# Altium project US_EPS_HW.PrjPcb (part 1 of 2)
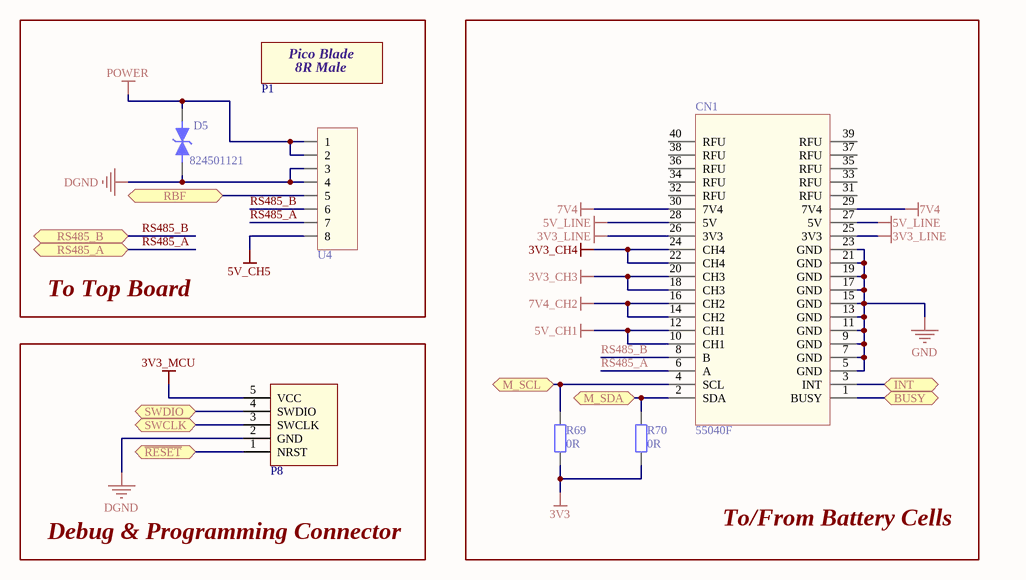
[diagram p0: US_EPS_BIC.SchDoc]
hwver: v0.2
9 sheets, 370 parts. Net scope: hierarchical (ports join the sheet entries above them; power ports are global).
Board file: US_EPS_GHW.PcbDoc
Sheets:
  US_EPS_BIC.SchDoc
  US_EPS_BR.SchDoc
  US_EPS_GHW.SchDoc
  US_EPS_HW.SchDoc
  US_EPS_LM.SchDoc
  US_EPS_MCU.SchDoc
  US_EPS_RBF.SchDoc
  US_EPS_RS485.SchDoc
  US_EPS_SP.SchDoc

## Sheet US_EPS_BIC.SchDoc
size A4

### Parts
CN1  55040F  [HEADER_40PIN_12MM2]
D5  824501121  [DIOM4227X25N]
P1  PicoBlade_8R_MALE  (value not drawn)  (mechanical)
P8  SWD  [SWD_CON_VAR1]  (value not drawn)  (no BOM)
R69  0R  [R0603_IPC_MD]  (no BOM)
R70  0R  [R0603_IPC_MD]  (no BOM)
U4  PicoBlade_8R  [PB_53398-0871_RIGHT]  (value not drawn)

### Blocks framed on the sheet
To Top Board: D5 P1 U4
To/From Battery Cells: CN1 R69 R70
Debug & Programming Connector: P8

### Ports
BUSY, INT, M_SCL, M_SDA, RBF, RS485_A (bidir), RS485_B (bidir), SWCLK, SWDIO, ~{RESET}

### Nets
3V3: R69.1 R70.1
3V3_CH3: CN1.18(CH3) CN1.20(CH3)
3V3_CH4: CN1.22(CH4) CN1.24(CH4)
3V3_LINE: CN1.25(3V3) CN1.26(3V3)
3V3_MCU: P8.5(VCC)
5V_CH1: CN1.10(CH1) CN1.12(CH1)
5V_CH5: U4.8
5V_LINE: CN1.27(5V) CN1.28(5V)
7V4: CN1.29(7V4) CN1.30(7V4)
7V4_CH2: CN1.14(CH2) CN1.16(CH2)
DGND: D5.1 P8.2(GND) U4.3 U4.4
GND: CN1.5(GND) CN1.7(GND) CN1.9(GND) CN1.11(GND) CN1.13(GND) CN1.15(GND) CN1.17(GND) CN1.19(GND) CN1.21(GND) CN1.23(GND)
POWER: D5.2 U4.1 U4.2
RS485_A: CN1.6(A) U4.7 ; port RS485_A
RS485_B: CN1.8(B) U4.6 ; port RS485_B
NetCN1_1: CN1.1(BUSY) ; port BUSY
NetCN1_2: CN1.2(SDA) R70.2 ; port M_SDA
NetCN1_3: CN1.3(INT) ; port INT
NetCN1_4: CN1.4(SCL) R69.2 ; port M_SCL
NetP8_1: P8.1(NRST) ; port ~{RESET}
NetP8_3: P8.3(SWCLK) ; port SWCLK
NetP8_4: P8.4(SWDIO) ; port SWDIO
NetU4_5: U4.5 ; port RBF

Not connected (* = marked no-connect by the designer): CN1 31(RFU) 32(RFU) 33(RFU) 34(RFU) 35(RFU) 36(RFU) 37(RFU) 38(RFU) 39(RFU) 40(RFU)

### Notes on the sheet
- (in symbol PicoBlade_8R_M) Pico Blade; 8R Male

### Library data of the parts
CN1 = ALFASAT_BIC: CONN HEADER R/A 40POS 2.54MM; Manufacturer: On Shore Technology Inc.; Manufacturer Part Number: 55040F; Supplier 1: LCSC; Supplier Part Number 1: C35165
D5 = 824501121_TVS: TVS DIODE 12V 19.9V DO214AC; Manufacturer: Wurth Electronics Inc.; Voltage - Reverse Standoff (Typ): 12V (Max); Current - Average Rectified (Io): 1A; Manufacturer Part Number: 824501121; Supplier 1: Digi-Key; Supplier Part Number 1: 732-9949-1-ND
P1 = PicoBlade_8R_M: MALE Connector Header Surface Mount, Right Angle 8 position 0.049" (1.25mm); Manufacturer: China; Manufacturer Part Number: PicoBlade_8R_MALE; Supplier 1: Aliexpress; Supplier Part Number 1: PicoBlade_8R_M
P8 = SWD-CONNECTOR_VAR1: SWDIO SWCLK VDD GND NRST; Manufacturer: *; Manufacturer Part Number: *; Supplier 1: *; Supplier Part Number 1: *
R69 R70 = CR0603-J/-000ELF: RES SMD 0 OHM JUMPER 1/10W 0603; Manufacturer: Bourns Inc.; Tolarance: 1%; Value: 0R; Manufacturer Part Number: CR0603-J/-000ELF; Supplier 1: Digi-Key; Supplier Part Number 1: CR0603-J/-000ELFCT-ND
U4 = PicoBlade_8R: Connector Header Surface Mount, Right Angle 8 position 0.049" (1.25mm); Manufacturer: China; Manufacturer Part Number: PicoBlade_8R; Supplier 1: Aliexpress; Supplier Part Number 1: PicoBlade_8R

## Sheet US_EPS_BR.SchDoc
size A3
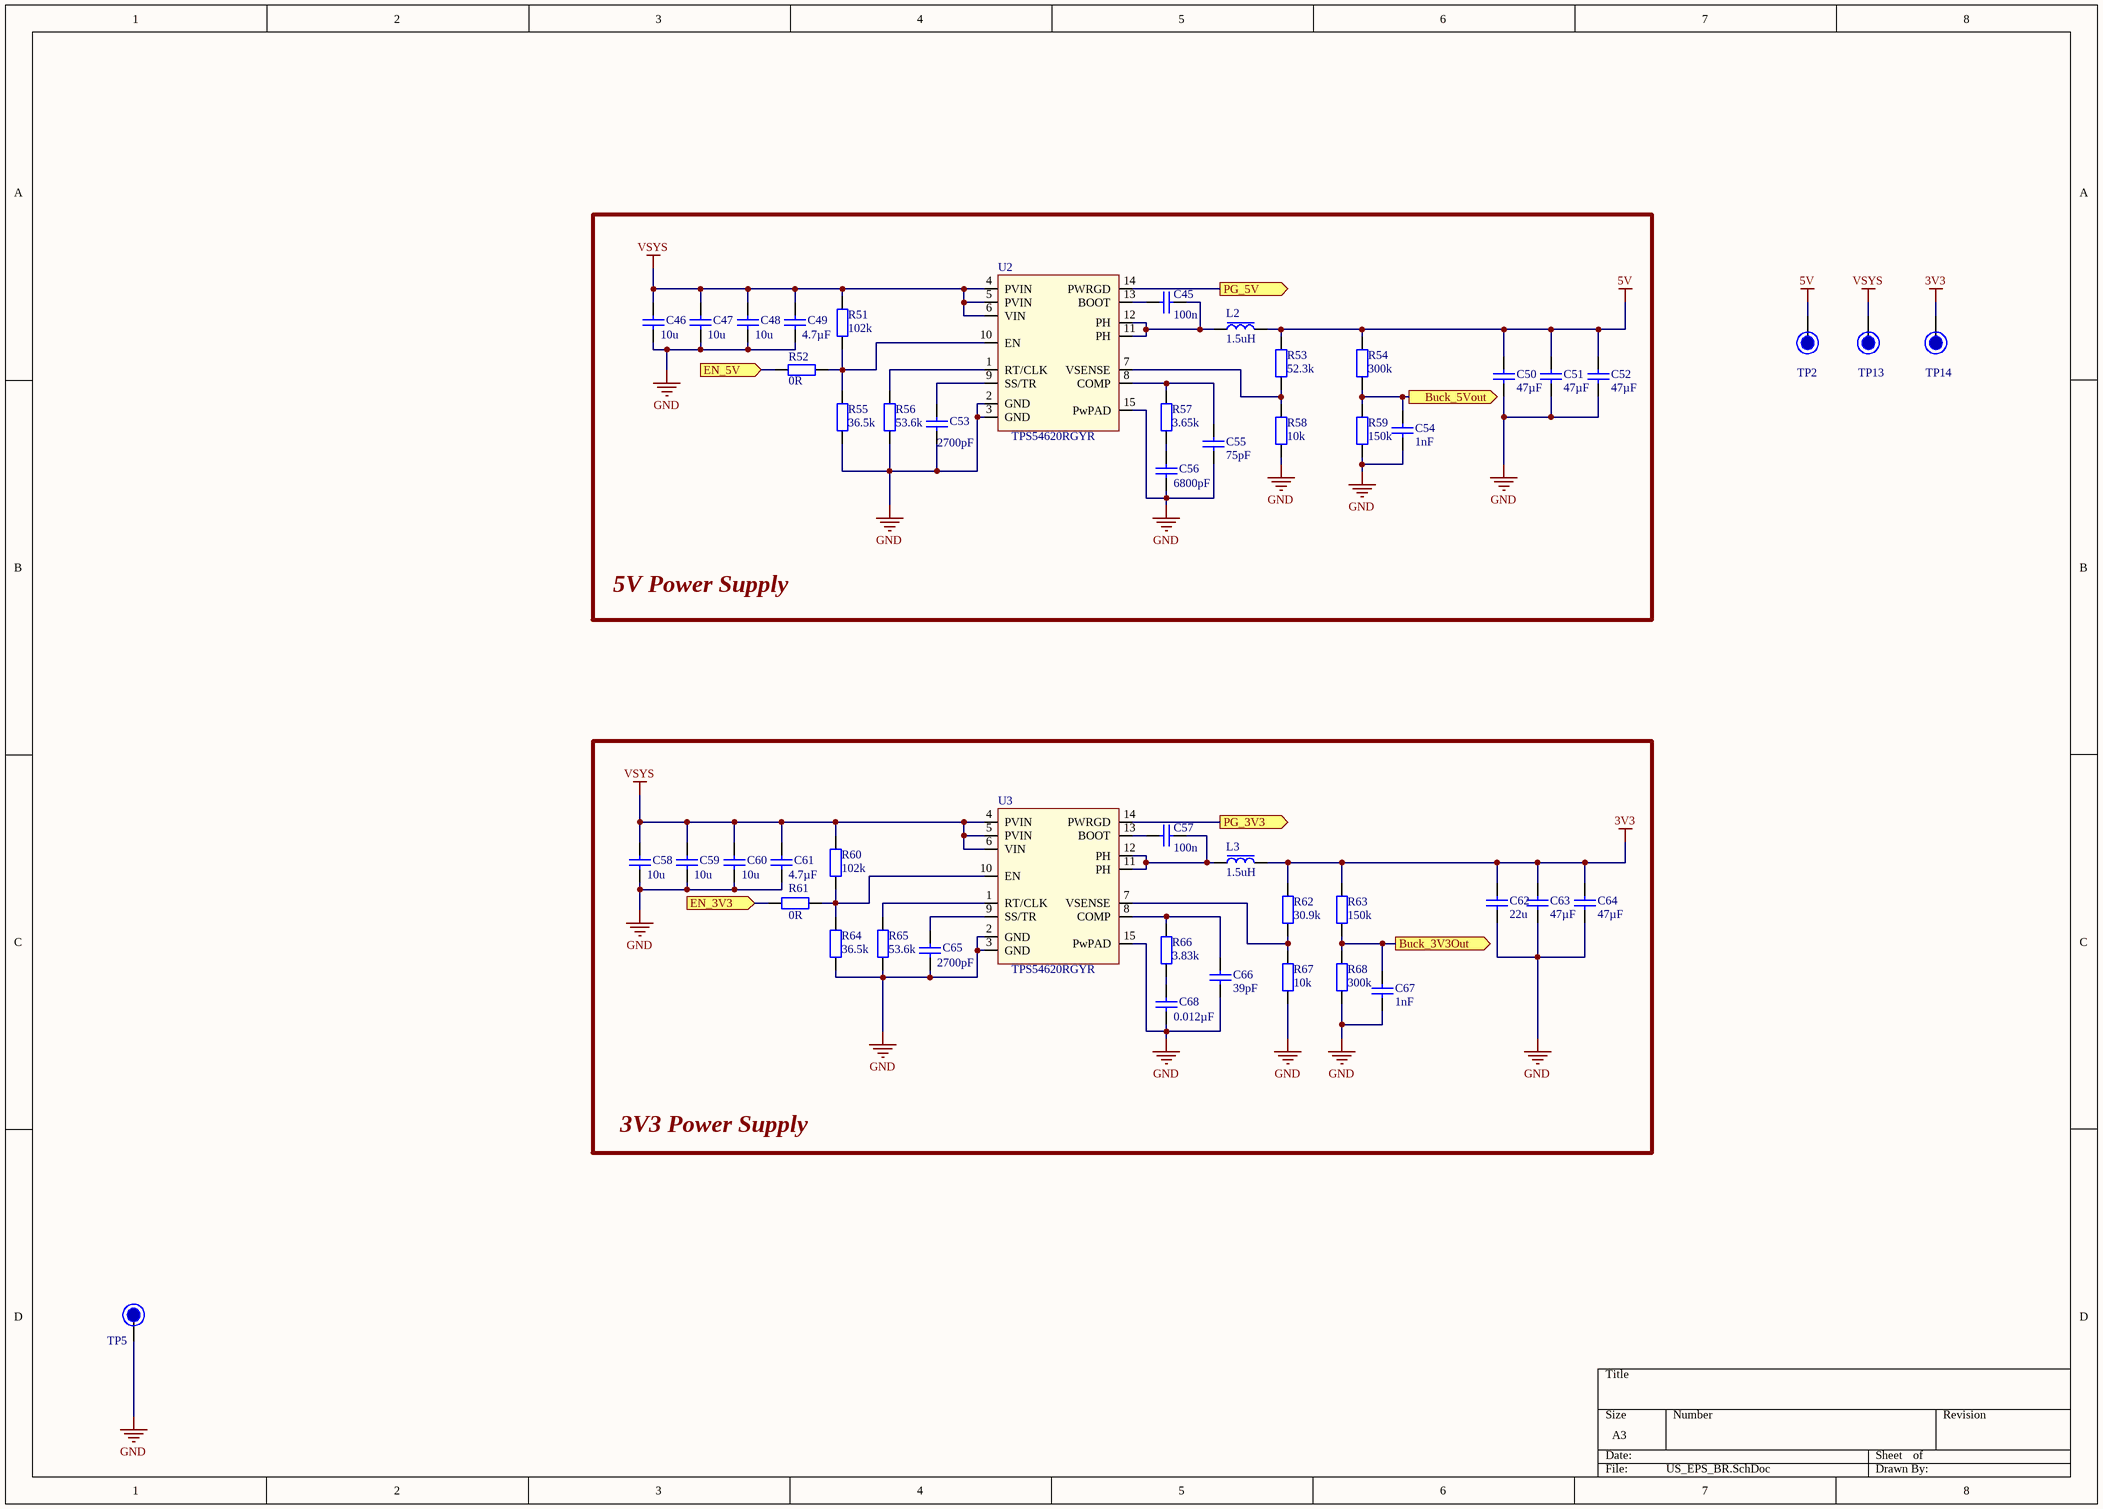
[diagram p1: US_EPS_BR.SchDoc]

### Parts
C45  100n  [C0603_IPC_HD]
C46  10u  [C0805_IPC_HD]
C47  10u  [C0805_IPC_HD]
C48  10u  [C0805_IPC_HD]
C49  4.7µF  [C0603_IPC_MD]
C50  47µF  [C1206_IPC_HD]
C51  47µF  [C1206_IPC_HD]
C52  47µF  [C1206_IPC_HD]
C53  2700pF  [C0603_IPC_HD]
C54  1nF  [C0603_IPC_HD]
C55  75pF  [C0603_IPC_HD]
C56  6800pF  [C0603_IPC_HD]
C57  100n  [C0603_IPC_HD]
C58  10u  [C0805_IPC_HD]
C59  10u  [C0805_IPC_HD]
C60  10u  [C0805_IPC_HD]
C61  4.7µF  [C0603_IPC_MD]
C62  22u  [C0805_IPC_HD]
C63  47µF  [C1206_IPC_HD]
C64  47µF  [C1206_IPC_HD]
C65  2700pF  [C0603_IPC_HD]
C66  39pF  [C0603_IPC_HD]
C67  1nF  [C0603_IPC_HD]
C68  0.012µF  [C0603_IPC_HD]
L2  1.5uH  [INDP8687X40N-(VLP8040 )]
L3  1.5uH  [INDP8687X40N-(VLP8040 )]
R51  102k  [C0603_IPC_HD]
R52  0R  [R0603_IPC_MD]
R53  52.3k  [C0603_IPC_HD]
R54  300k  [R0603_IPC_MD]
R55  36.5k  [C0603_IPC_HD]
R56  53.6k  [C0603_IPC_HD]
R57  3.65k  [C0603_IPC_HD]
R58  10k  [C0603_IPC_HD]
R59  150k  [R0603_IPC_MD]
R60  102k  [C0603_IPC_HD]
R61  0R  [R0603_IPC_MD]
R62  30.9k  [C0603_IPC_HD]
R63  150k  [R0603_IPC_MD]
R64  36.5k  [C0603_IPC_HD]
R65  53.6k  [C0603_IPC_HD]
R66  3.83k  [C0603_IPC_HD]
R67  10k  [C0603_IPC_HD]
R68  300k  [R0603_IPC_MD]
TP2  Test Point  [TestPoint_1M5]  (value not drawn)  (no BOM)
TP5  Test Point  [TestPoint_1M5]  (value not drawn)  (no BOM)
TP13  Test Point  [TestPoint_1M5]  (value not drawn)  (no BOM)
TP14  Test Point  [TestPoint_1M5]  (value not drawn)  (no BOM)
U2  TPS54620RGYR  [14-VFQFN-(TPS54620RGYR)]
U3  TPS54620RGYR  [14-VFQFN-(TPS54620RGYR)]

### Blocks framed on the sheet
5V Power Supply: C45-C56 L2 R51-R59 U2
3V3 Power Supply: C57-C68 L3 R60-R68 U3

### Ports
Buck_3V3Out (out), Buck_5Vout (out), EN_3V3 (in), EN_5V (in), PG_3V3 (out), PG_5V (out)

### Nets
3V3: C62.2 C63.2 C64.2 L3.2 R62.2 R63.2 TP14.0
5V: C50.2 C51.2 C52.2 L2.2 R53.2 R54.2 TP2.0
GND: C46.1 C47.1 C48.1 C49.1 C50.1 C51.1 C52.1 C53.1 C54.1 C55.1 C56.1 C58.1 C59.1 C60.1 C61.1 C62.1 C63.1 C64.1 C65.1 C66.1 C67.1 C68.1 R55.1 R56.1 R58.1 R59.1 R64.1 R65.1 R67.1 R68.1 TP5.0 U2.2(GND) U2.3(GND) U2.15(PwPAD) U3.2(GND) U3.3(GND) U3.15(PwPAD)
VSYS: C46.2 C47.2 C48.2 C49.2 C58.2 C59.2 C60.2 C61.2 R51.2 R60.2 TP13.0 U2.4(PVIN) U2.5(PVIN) U2.6(VIN) U3.4(PVIN) U3.5(PVIN) U3.6(VIN)
NetC45_1: C45.1 L2.1 U2.11(PH) U2.12(PH)
NetC45_2: C45.2 U2.13(BOOT)
NetC53_2: C53.2 U2.9(SS/TR)
NetC54_2: C54.2 R54.1 R59.2 ; port Buck_5Vout
NetC55_2: C55.2 R57.2 U2.8(COMP)
NetC56_2: C56.2 R57.1
NetC57_1: C57.1 L3.1 U3.11(PH) U3.12(PH)
NetC57_2: C57.2 U3.13(BOOT)
NetC65_2: C65.2 U3.9(SS/TR)
NetC66_2: C66.2 R66.2 U3.8(COMP)
NetC67_2: C67.2 R63.1 R68.2 ; port Buck_3V3Out
NetC68_2: C68.2 R66.1
NetR51_1: R51.1 R52.1 R55.2 U2.10(EN)
NetR52_2: R52.2 ; port EN_5V
NetR53_1: R53.1 R58.2 U2.7(VSENSE)
NetR56_2: R56.2 U2.1(RT/CLK)
NetR60_1: R60.1 R61.1 R64.2 U3.10(EN)
NetR61_2: R61.2 ; port EN_3V3
NetR62_1: R62.1 R67.2 U3.7(VSENSE)
NetR65_2: R65.2 U3.1(RT/CLK)
NetU2_14: U2.14(PWRGD) ; port PG_5V
NetU3_14: U3.14(PWRGD) ; port PG_3V3

### Library data of the parts
C45 C57 = CL10B104KO8NNNC: CAP CER 0.1UF 16V X7R 0603; Manufacturer: Samsung Electro-Mechanics; Manufacturer Part Number: CL10B104KO8NNNC; Voltage: 16V; Value: 100n; Dielectric: X7R; Supplier 1: Digi-Key; Supplier Part Number 1: 1276-1005-1-ND
C46-C48 C58-C60 = CL21B106KOQNNNG: CAP CER 10UF 16V X7R 0805; Manufacturer: Samsung Electro-Mechanics; Manufacturer Part Number: CL21B106KOQNNNG; Voltage: 16V; Value: 10u; Dielectric: X7R; Supplier 1: Digi-Key; Supplier Part Number 1: 1276-6472-1-ND
C49 C61 = CL0603_4.7uF_10V: 4.7µF ±10% 10V Ceramic Capacitor X5R 0603 (1608 Metric); Manufacturer: Samsung Electro-Mechanics; Manufacturer Part Number: CL10A475KP8NNNC; Dielectric: X7R; Voltage: 10V; Value: 4.7µF; Supplier 1: Digi-Key; Supplier Part Number 1: 1276-1044-1-ND
C50-C52 C63 C64 = CL1206_47uF_10V: CAP CER 47UF 10V X5R 1206; Manufacturer: Samsung Electro-Mechanics; Manufacturer Part Number: CL31A476MPHNNNE; Dielectric: X7R; Voltage: 10V; Value: 47µF; Supplier 1: Digi-Key; Supplier Part Number 1: 1276-3063-1-ND
C53 C65 = CL0603_2700pF_50V: CAP CER 2700PF 50V X7R 0603; Manufacturer: Yageo; Manufacturer Part Number: CC0603KRX7R9BB272; Voltage: 50V; Value: 2700pF; Dielectric: X7R; Supplier 1: Digi-Key; Supplier Part Number 1: 311-1809-1-ND
C54 C67 = CL0603_1nF_0603: CAP CER 1000PF 50V X7R 0603; Manufacturer: Samsung Electro-Mechanics; Manufacturer Part Number: CL10B102KB8NNNC; Voltage: 50V; Value: 1nF; Dielectric: X7R; Supplier 1: Digi-Key; Supplier Part Number 1: 1276-1018-1-ND
C55 = C0603_75pF_50V: CAP CER 75PF 50V C0G/NP0 0603; Manufacturer: Samsung Electro-Mechanics; Manufacturer Part Number: CL10C750JB8NNNC; Dielectric: X7R; Voltage: 50V; Value: 75pF; Supplier 1: Digi-Key; Supplier Part Number 1: 1276-2335-1-ND
C56 = CL0603_6.8nF_50V: CAP CER 6800PF 50V X7R 0603; Manufacturer: TDK Corporation; Manufacturer Part Number: C1608X7R1H682M; Voltage: 50V; Value: 6800pF; Dielectric: X7R; Supplier 1: Digi-Key; Supplier Part Number 1: 445-5088-1-ND
C62 = CL21A226MOCLRNC: CAP CER 22UF 16V X5R 0805; Manufacturer: Samsung Electro-Mechanics; Manufacturer Part Number: CL21A226MOCLRNC; Voltage: 16V; Value: 22u; Dielectric: X5R; Supplier 1: Digi-Key; Supplier Part Number 1: 1276-6780-1-ND
C66 = CL0603_39pF_50V: CAP CER 39PF 50V C0G/NP0 0603; Manufacturer: Samsung Electro-Mechanics; Manufacturer Part Number: CL10C390JB8NNNC; Dielectric: X7R; Voltage: 50V; Value: 39pF; Supplier 1: Digi-Key; Supplier Part Number 1: 1276-1087-1-ND
C68 = C0603_12nF_25V: CAP CER 0.012UF 25V C0G/NP0 0603; Manufacturer: KEMET; Manufacturer Part Number: C0603C123J3GACTU; Dielectric: X7R; Voltage: 25V; Value: 0.012µF; Supplier 1: Digi-Key; Supplier Part Number 1: 399-8997-1-ND
L2 L3 = 1.5µH Shielded Wirewound Inductor 6.7A 13mOhm Max Nonstandard: FIXED IND 1.5UH 6.7A 13 MOHM SMD; Manufacturer: TDK Corporation; Manufacturer Part Number: VLP8040T-1R5N; Value: 1.5uH; Supplier 1: Digi-Key; Supplier Part Number 1: 445-6575-1-ND
R51 R60 = CR0603-JW-102K: RES 102K OHM 1% 1/10W 0603; Manufacturer: KOA Speer Electronics, Inc.; Manufacturer Part Number: RK73H1JTTD1023F; Value: 102k; Tolarance: ±1%; Supplier 1: Digi-Key; Supplier Part Number 1: 2019-RK73H1JTTD1023FCT-ND
R52 R61 = CR0603-J/-000ELF: as R69 on sheet US_EPS_BIC; Value: 0R; Manufacturer Part Number: CR0603-J/-000ELF; Supplier 1: Digi-Key; Supplier Part Number 1: CR0603-J/-000ELFCT-ND
R53 = CR0603-JW-52.3k: RES SMD 52.3K OHM 1% 1/10W 0603; Manufacturer: Yageo; Manufacturer Part Number: RC0603FR-0752K3L; Value: 52.3k; Tolarance: ±1%; Supplier 1: Digi-Key; Supplier Part Number 1: 311-52.3KHRCT-ND
R54 R68 = RC0603FR-07300KL: RES SMD 300K OHM 1% 1/10W 0603; Manufacturer: YAGEO; Value: 300k; Tolarance: 1%; Manufacturer Part Number: RC0603FR-07300KL; Supplier 1: Digi-Key; Supplier Part Number 1: 311-300KHRCT-ND
R55 R64 = CR0603-JW-36.5K: RES 36.5K OHM 1% 1/10W 0603; Manufacturer: KOA Speer Electronics, Inc.; Manufacturer Part Number: RK73H1JTTD3652F; Value: 36.5k; Tolarance: ±1%; Supplier 1: Digi-Key; Supplier Part Number 1: 2019-RK73H1JTTD3652FCT-ND
R56 R65 = CR0603-JW-53.6k: RES 53.6K OHM 1% 1/10W 0603; Manufacturer: KOA Speer Electronics, Inc.; Manufacturer Part Number: RK73H1JTTD5362F; Value: 53.6k; Tolarance: ±1%; Supplier 1: Digi-Key; Supplier Part Number 1: 2019-RK73H1JTTD5362FCT-ND
R57 = CR0603-JW-3.65k: RES SMD 3.65K OHM 1% 1/10W 0603; Manufacturer: Yageo; Manufacturer Part Number: RC0603FR-073K65L; Value: 3.65k; Tolarance: ±1%; Supplier 1: Digi-Key; Supplier Part Number 1: 311-3.65KHRCT-ND
R58 = CR0603-JW-10к: RES 10K OHM 1% 1/10W 0603; Manufacturer: Stackpole Electronics Inc; Manufacturer Part Number: RMCF0603FT10K0; Value: 10k; Tolarance: ±1%; Supplier 1: Digi-Key; Supplier Part Number 1: RMCF0603FT10K0CT-ND
R59 R63 = RC0603FR-07150KL: RES SMD 150K OHM 1% 1/10W 0603; Manufacturer: YAGEO; Value: 150k; Tolarance: 1%; Manufacturer Part Number: RC0603FR-07150KL; Supplier 1: Digi-Key; Supplier Part Number 1: 311-150KHRCT-ND
R62 = CR0603-JW-30.9k: RES SMD 30.9K OHM 1% 1/10W 0603; Manufacturer: Yageo; Manufacturer Part Number: RC0603FR-0730K9L; Value: 30.9k; Tolarance: ±1%; Supplier 1: Digi-Key; Supplier Part Number 1: 311-30.9KHRCT-ND
R66 = CR0603-JW-3.83k: RES SMD 3.83K OHM 1% 1/10W 0603; Manufacturer: Yageo; Manufacturer Part Number: RC0603FR-073K83L; Value: 3.83k; Tolarance: ±1%; Supplier 1: Digi-Key; Supplier Part Number 1: 311-3.83KHRCT-ND
R67 = CR0603-JW-10k: RES 10K OHM 1% 1/10W 0603; Manufacturer: Stackpole Electronics Inc; Manufacturer Part Number: RMCF0603FT10K0; Value: 10k; Tolarance: ±1%; Supplier 1: Digi-Key; Supplier Part Number 1: RMCF0603FT10K0CT-ND
TP2 TP5 TP13 TP14 = TP
U2 U3 = TPS54620RGYR: IC REG BUCK ADJUSTABLE 6A 14VQFN; Manufacturer: Texas Instruments; Manufacturer Part Number: TPS54620RGYR; Supplier 1: Digi-Key; Supplier Part Number 1: 296-24554-1-ND

## Sheet US_EPS_GHW.SchDoc
size A4
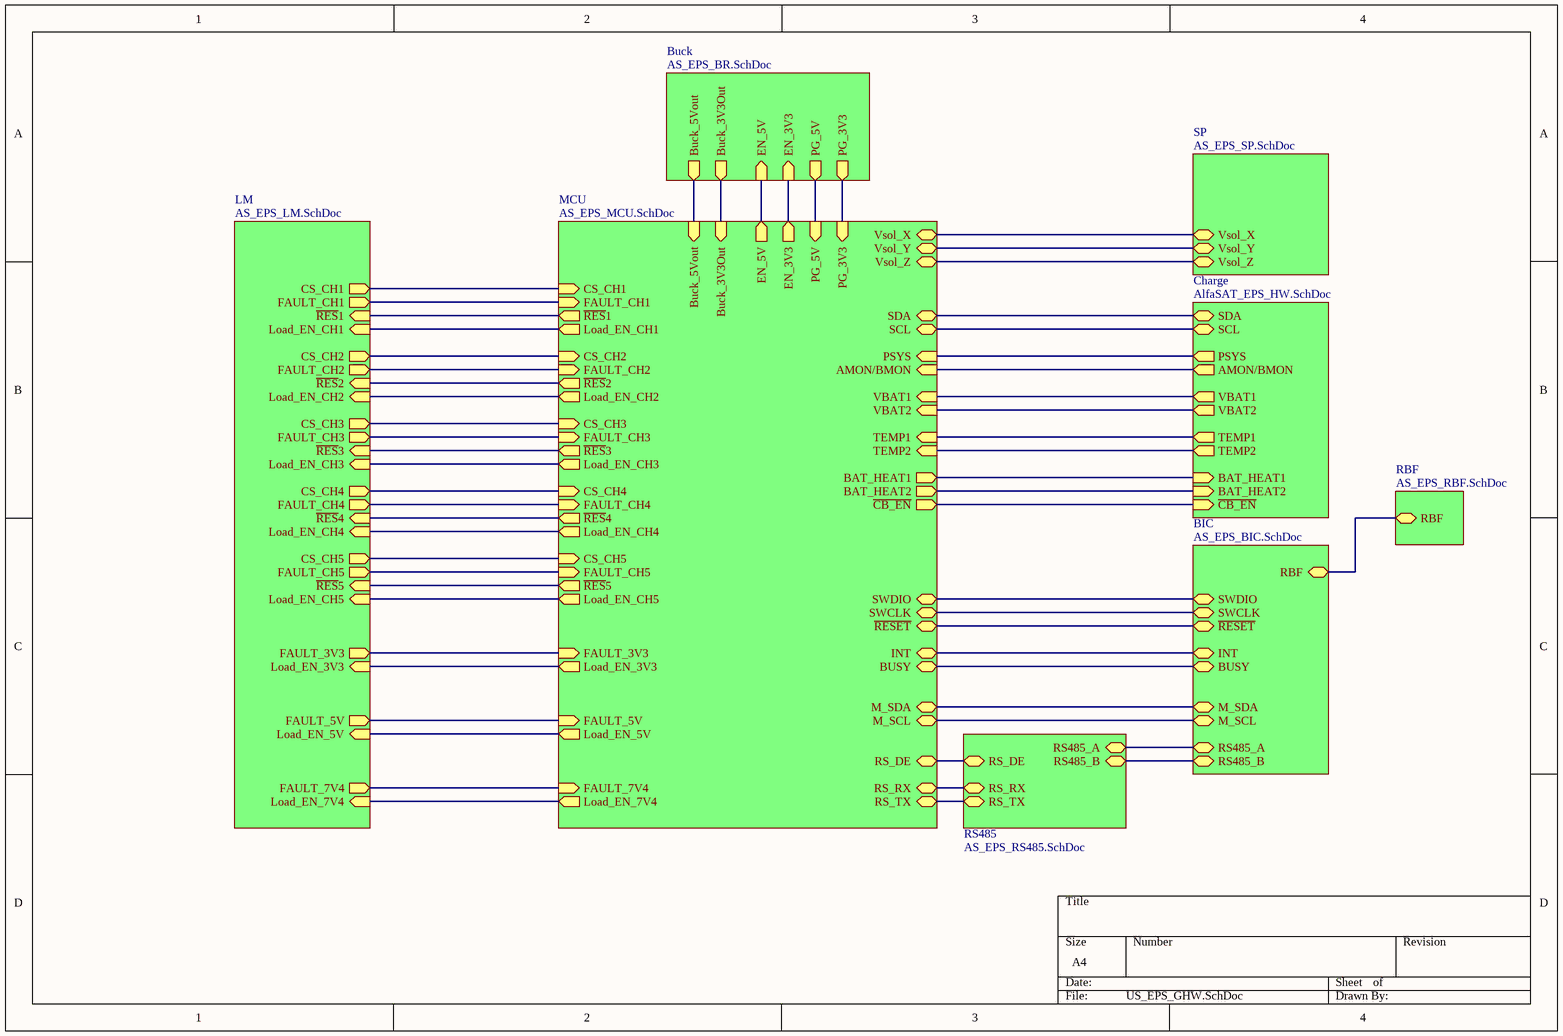
[diagram p2: US_EPS_GHW.SchDoc]

### Sub-sheets
BIC = AS_EPS_BIC.SchDoc (file not in this document): RBF, RS485_A, RS485_B, M_SCL, M_SDA, BUSY, INT, SWDIO, SWCLK, ~{RESET}
Buck = AS_EPS_BR.SchDoc (file not in this document): Buck_5Vout (out), Buck_3V3Out (out), EN_5V (in), EN_3V3 (in), PG_5V (out), PG_3V3 (out)
Charge = AlfaSAT_EPS_HW.SchDoc (file not in this document): AMON/BMON (out), PSYS (out), VBAT2 (out), TEMP2 (out), VBAT1 (out), TEMP1 (out), BAT_HEAT2 (in), BAT_HEAT1 (in), SCL, SDA, ~{CB_EN} (in)
LM = AS_EPS_LM.SchDoc (file not in this document): CS_CH1 (out), ~{RES}1 (in), FAULT_CH1 (out), Load_EN_CH1 (in), CS_CH2 (out), ~{RES}2 (in), FAULT_CH2 (out), Load_EN_CH2 (in), CS_CH3 (out), ~{RES}3 (in), FAULT_CH3 (out), Load_EN_CH3 (in), CS_CH4 (out), ~{RES}4 (in), FAULT_CH4 (out), Load_EN_CH4 (in), CS_CH5 (out), ~{RES}5 (in), FAULT_CH5 (out), Load_EN_CH5 (in), FAULT_3V3 (out), Load_EN_3V3 (in), FAULT_5V (out), Load_EN_5V (in), FAULT_7V4 (out), Load_EN_7V4 (in)
MCU = AS_EPS_MCU.SchDoc (file not in this document): SDA, SCL, PSYS (in), AMON/BMON (in), VBAT1 (in), VBAT2 (in), TEMP1 (in), TEMP2 (in), BAT_HEAT1 (out), BAT_HEAT2 (out), EN_3V3 (out), EN_5V (out), Buck_3V3Out (in), Buck_5Vout (in), CS_CH1 (in), ~{RES}1 (out), FAULT_CH1 (in), Load_EN_CH1 (out), CS_CH2 (in), ~{RES}2 (out), FAULT_CH2 (in), Load_EN_CH2 (out), CS_CH3 (in), ~{RES}3 (out), FAULT_CH3 (in), Load_EN_CH3 (out), CS_CH4 (in), ~{RES}4 (out), FAULT_CH4 (in), Load_EN_CH4 (out), CS_CH5 (in), ~{RES}5 (out), FAULT_CH5 (in), Load_EN_CH5 (out), FAULT_3V3 (in), Load_EN_3V3 (out), FAULT_5V (in), Load_EN_5V (out), FAULT_7V4 (in), Load_EN_7V4 (out), RS_DE, RS_TX, RS_RX, SWDIO, SWCLK, ~{RESET}, INT, BUSY, M_SDA, M_SCL, Vsol_X, Vsol_Z, Vsol_Y, ~{CB_EN} (out), PG_5V (in), PG_3V3 (in)
RBF = AS_EPS_RBF.SchDoc (file not in this document): RBF
RS485 = AS_EPS_RS485.SchDoc (file not in this document): RS_TX, RS_RX, RS_DE, RS485_B, RS485_A
SP = AS_EPS_SP.SchDoc (file not in this document): Vsol_X, Vsol_Z, Vsol_Y

### Nets
(unnamed): sheet Charge/AMON/BMON, sheet MCU/AMON/BMON
(unnamed): sheet Charge/PSYS, sheet MCU/PSYS
(unnamed): sheet Charge/VBAT2, sheet MCU/VBAT2
(unnamed): sheet Charge/TEMP2, sheet MCU/TEMP2
(unnamed): sheet Charge/VBAT1, sheet MCU/VBAT1
(unnamed): sheet Charge/TEMP1, sheet MCU/TEMP1
(unnamed): sheet Charge/BAT_HEAT2, sheet MCU/BAT_HEAT2
(unnamed): sheet Charge/BAT_HEAT1, sheet MCU/BAT_HEAT1
(unnamed): sheet Charge/SCL, sheet MCU/SCL
(unnamed): sheet Charge/SDA, sheet MCU/SDA
(unnamed): sheet Charge/~{CB_EN}, sheet MCU/~{CB_EN}
(unnamed): sheet MCU/EN_3V3, sheet Buck/EN_3V3
(unnamed): sheet MCU/EN_5V, sheet Buck/EN_5V
(unnamed): sheet MCU/Buck_3V3Out, sheet Buck/Buck_3V3Out
(unnamed): sheet MCU/Buck_5Vout, sheet Buck/Buck_5Vout
(unnamed): sheet MCU/CS_CH1, sheet LM/CS_CH1
(unnamed): sheet MCU/~{RES}1, sheet LM/~{RES}1
(unnamed): sheet MCU/FAULT_CH1, sheet LM/FAULT_CH1
(unnamed): sheet MCU/Load_EN_CH1, sheet LM/Load_EN_CH1
(unnamed): sheet MCU/CS_CH2, sheet LM/CS_CH2
(unnamed): sheet MCU/~{RES}2, sheet LM/~{RES}2
(unnamed): sheet MCU/FAULT_CH2, sheet LM/FAULT_CH2
(unnamed): sheet MCU/Load_EN_CH2, sheet LM/Load_EN_CH2
(unnamed): sheet MCU/CS_CH3, sheet LM/CS_CH3
(unnamed): sheet MCU/~{RES}3, sheet LM/~{RES}3
(unnamed): sheet MCU/FAULT_CH3, sheet LM/FAULT_CH3
(unnamed): sheet MCU/Load_EN_CH3, sheet LM/Load_EN_CH3
(unnamed): sheet MCU/CS_CH4, sheet LM/CS_CH4
(unnamed): sheet MCU/~{RES}4, sheet LM/~{RES}4
(unnamed): sheet MCU/FAULT_CH4, sheet LM/FAULT_CH4
(unnamed): sheet MCU/Load_EN_CH4, sheet LM/Load_EN_CH4
(unnamed): sheet MCU/CS_CH5, sheet LM/CS_CH5
(unnamed): sheet MCU/~{RES}5, sheet LM/~{RES}5
(unnamed): sheet MCU/FAULT_CH5, sheet LM/FAULT_CH5
(unnamed): sheet MCU/Load_EN_CH5, sheet LM/Load_EN_CH5
(unnamed): sheet MCU/FAULT_3V3, sheet LM/FAULT_3V3
(unnamed): sheet MCU/Load_EN_3V3, sheet LM/Load_EN_3V3
(unnamed): sheet MCU/FAULT_5V, sheet LM/FAULT_5V
(unnamed): sheet MCU/Load_EN_5V, sheet LM/Load_EN_5V
(unnamed): sheet MCU/FAULT_7V4, sheet LM/FAULT_7V4
(unnamed): sheet MCU/Load_EN_7V4, sheet LM/Load_EN_7V4
(unnamed): sheet MCU/RS_DE, sheet RS485/RS_DE
(unnamed): sheet MCU/RS_TX, sheet RS485/RS_TX
(unnamed): sheet MCU/RS_RX, sheet RS485/RS_RX
(unnamed): sheet MCU/SWDIO, sheet BIC/SWDIO
(unnamed): sheet MCU/SWCLK, sheet BIC/SWCLK
(unnamed): sheet MCU/~{RESET}, sheet BIC/~{RESET}
(unnamed): sheet MCU/INT, sheet BIC/INT
(unnamed): sheet MCU/BUSY, sheet BIC/BUSY
(unnamed): sheet MCU/M_SDA, sheet BIC/M_SDA
(unnamed): sheet MCU/M_SCL, sheet BIC/M_SCL
(unnamed): sheet MCU/Vsol_X, sheet SP/Vsol_X
(unnamed): sheet MCU/Vsol_Z, sheet SP/Vsol_Z
(unnamed): sheet MCU/Vsol_Y, sheet SP/Vsol_Y
(unnamed): sheet MCU/PG_5V, sheet Buck/PG_5V
(unnamed): sheet MCU/PG_3V3, sheet Buck/PG_3V3
(unnamed): sheet RBF/RBF, sheet BIC/RBF
(unnamed): sheet RS485/RS485_B, sheet BIC/RS485_B
(unnamed): sheet RS485/RS485_A, sheet BIC/RS485_A

## Sheet US_EPS_HW.SchDoc
size A3
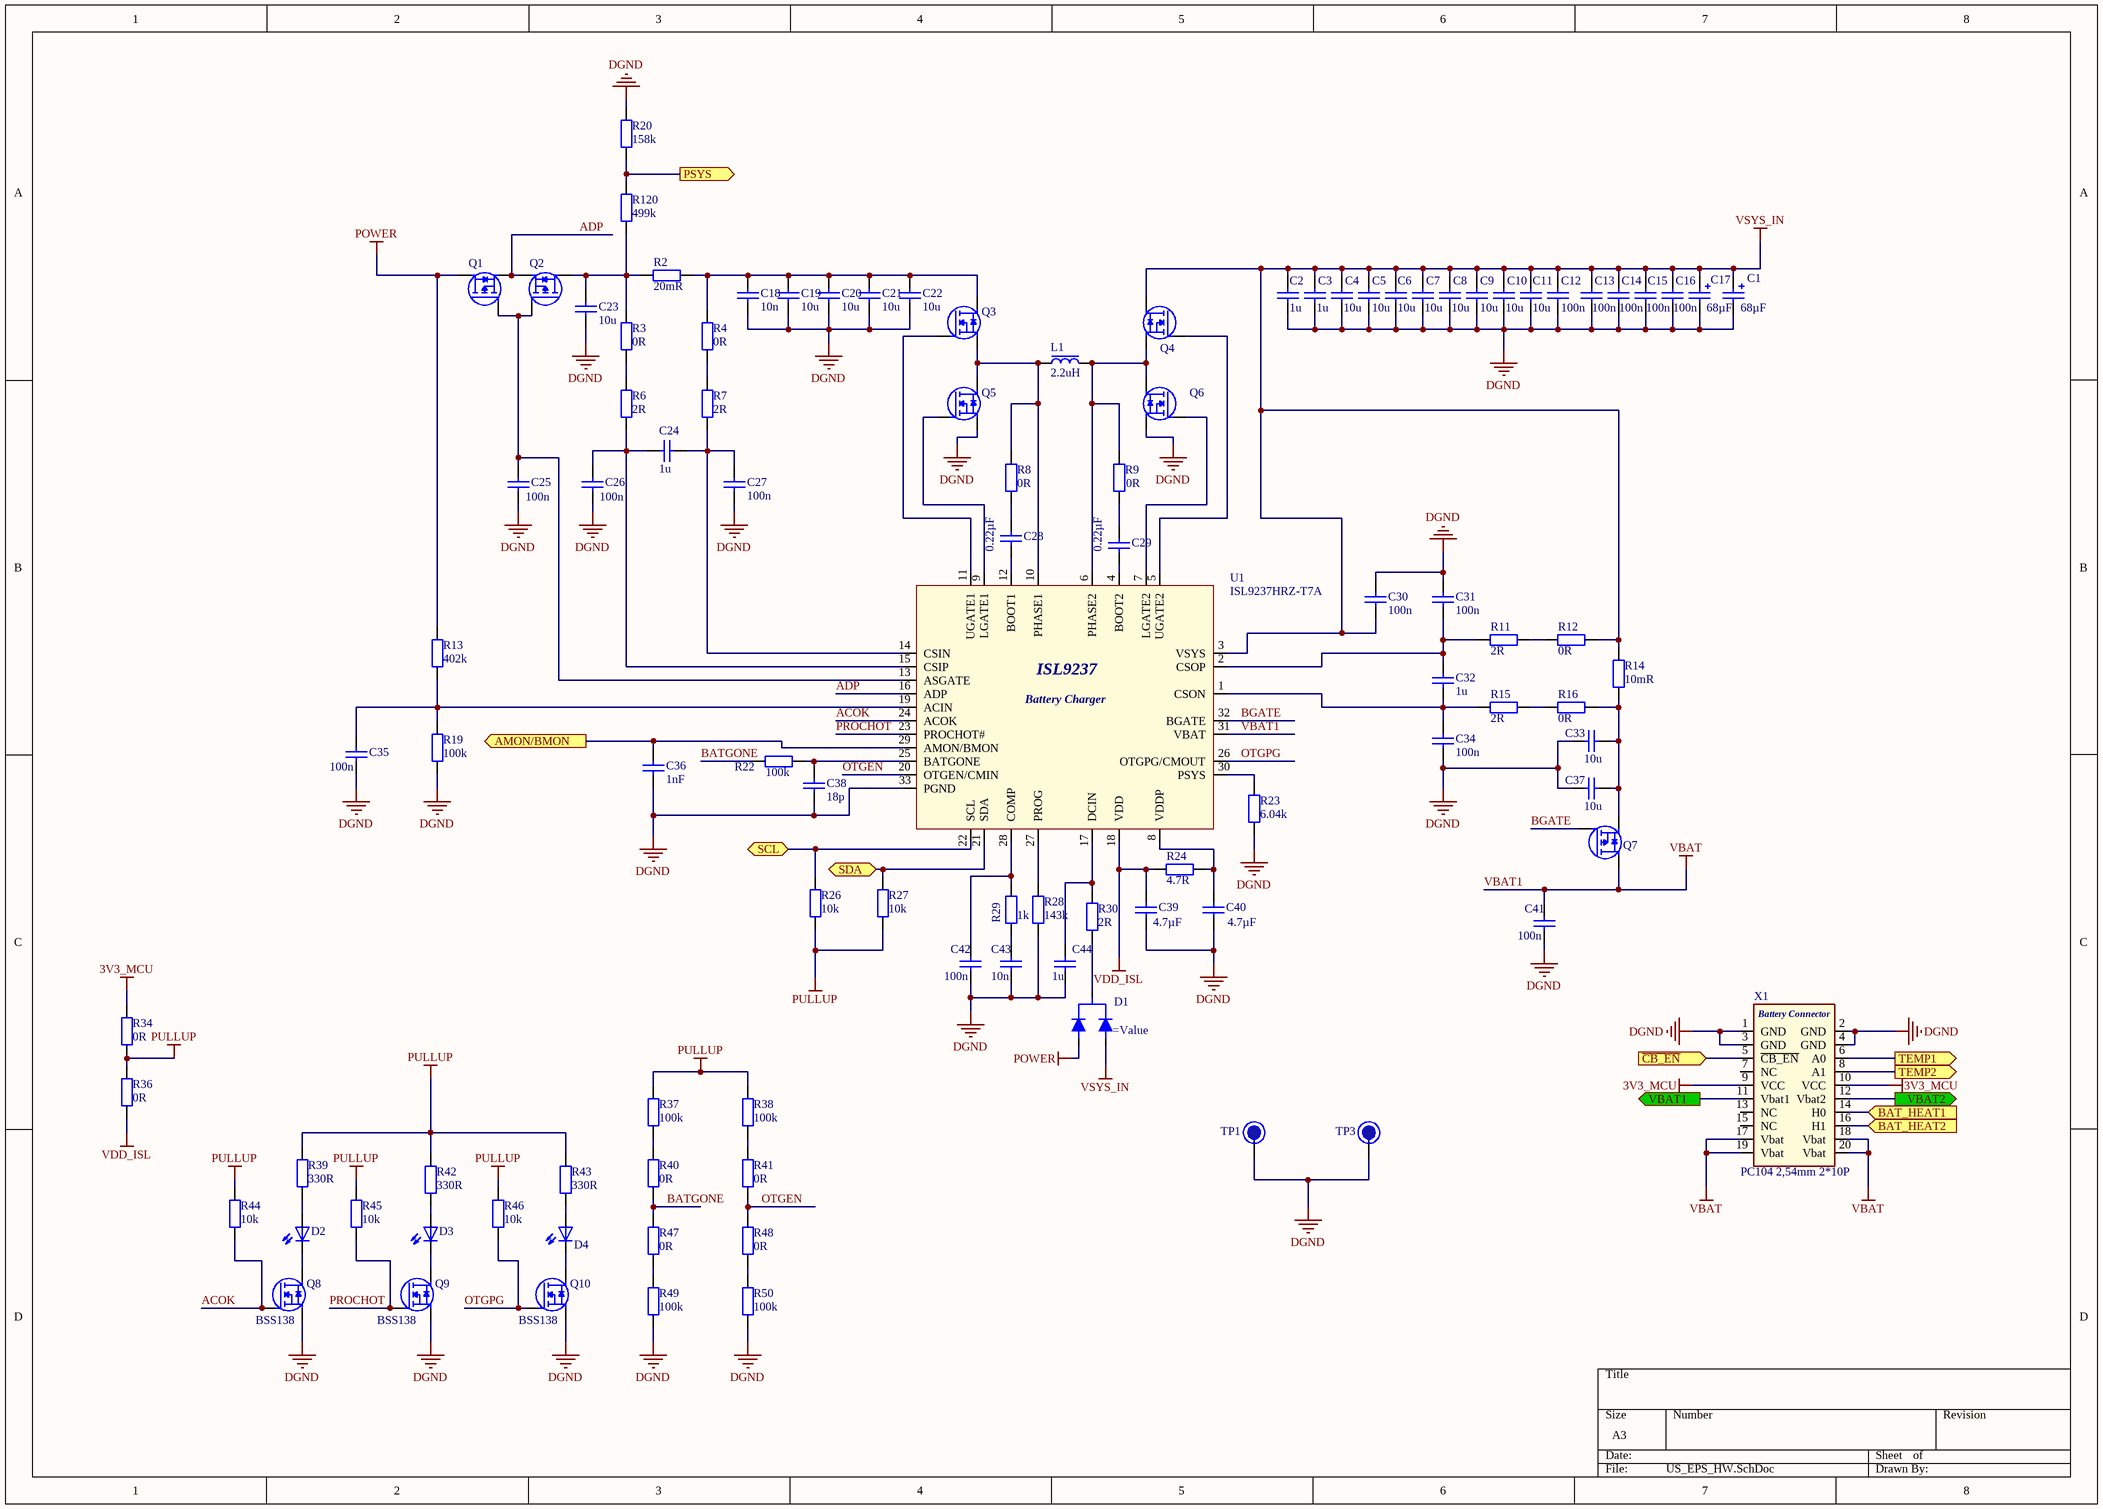
[diagram p3: US_EPS_HW.SchDoc]

### Parts
C1  68µF  [TCJY686_CAPMP7343X21N]
C2  1u  [C0603_IPC_HD]
C3  1u  [C0603_IPC_HD]
C4  10u  [C0805_IPC_HD]
C5  10u  [C0805_IPC_HD]
C6  10u  [C0805_IPC_HD]
C7  10u  [C0805_IPC_HD]
C8  10u  [C0805_IPC_HD]
C9  10u  [C0805_IPC_HD]
C10  10u  [C0805_IPC_HD]
C11  10u  [C0805_IPC_HD]
C12  100n  [C0603_IPC_HD]
C13  100n  [C0603_IPC_HD]
C14  100n  [C0603_IPC_HD]
C15  100n  [C0603_IPC_HD]
C16  100n  [C0603_IPC_HD]
C17  68µF  [TCJY686_CAPMP7343X21N]
C18  10n  [C0603_IPC_HD]
C19  10u  [C0805_IPC_HD]
C20  10u  [C0805_IPC_HD]
C21  10u  [C0805_IPC_HD]
C22  10u  [C0805_IPC_HD]
C23  10u  [C0805_IPC_HD]
C24  1u  [C0603_IPC_HD]
C25  100n  [C0603_IPC_HD]
C26  100n  [C0603_IPC_HD]
C27  100n  [C0603_IPC_HD]
C28  0.22µF  [C0603_IPC_MD]
C29  0.22µF  [C0603_IPC_MD]
C30  100n  [C0603_IPC_HD]
C31  100n  [C0603_IPC_HD]
C32  1u  [C0603_IPC_HD]
C33  10u  [C0805_IPC_HD]
C34  100n  [C0603_IPC_HD]
C35  100n  [C0603_IPC_HD]
C36  1nF  [C0603_IPC_MD]
C37  10u  [C0805_IPC_HD]
C38  18p  [C0603_IPC_HD]
C39  4.7µF  [C0603_IPC_MD]
C40  4.7µF  [C0603_IPC_MD]
C41  100n  [C0603_IPC_HD]
C42  100n  [C0603_IPC_HD]
C43  10n  [C0603_IPC_HD]
C44  1u  [C0603_IPC_HD]
D1  (no value)  [BAT54C_SOT23]
D2  LTST-C190GKT  [LED_0603]  (value not drawn)
D3  LTST-C190GKT  [LED_0603]  (value not drawn)
D4  LTST-C190GKT  [LED_0603]  (value not drawn)
L1  2.2uH  [2.2uF_6.3A]
Q1  SISH625DN-T1-GE3  [SISH625DN]  (value not drawn)
Q2  SISH625DN-T1-GE3  [SISH625DN]  (value not drawn)
Q3  SISA14DN-T1-GE3  [SISA14DN]  (value not drawn)
Q4  SISA14DN-T1-GE3  [SISA14DN]  (value not drawn)
Q5  SISA14DN-T1-GE3  [SISA14DN]  (value not drawn)
Q6  SISA14DN-T1-GE3  [SISA14DN]  (value not drawn)
Q7  SISH625DN-T1-GE3  [SISH625DN]  (value not drawn)
Q8  BSS138  [SOT23]
Q9  BSS138  [SOT23]
Q10  BSS138  [SOT23]
R2  20mR  [WSLP1206R002]
R3  0R  [R0603_IPC_MD]
R4  0R  [R0603_IPC_MD]
R6  2R  [C0603_IPC_HD]
R7  2R  [C0603_IPC_HD]
R8  0R  [R0603_IPC_MD]
R9  0R  [R0603_IPC_MD]
R11  2R  [C0603_IPC_HD]
R12  0R  [R0603_IPC_MD]
R13  402k  [C0603_IPC_HD]
R14  10mR  [WSLP1206R001]
R15  2R  [C0603_IPC_HD]
R16  0R  [R0603_IPC_MD]
R19  100k  [R0603_IPC_MD]
R20  158k  [R0603_IPC_HD]
R22  100k  [R0603_IPC_MD]
R23  6.04k  [C0603_IPC_HD]
R24  4.7R  [R0603_IPC_HD]
R26  10k  [C0603_IPC_HD]
R27  10k  [C0603_IPC_HD]
R28  143k  [C0603_IPC_HD]
R29  1k  [R0603_IPC_MD]
R30  2R  [C0603_IPC_HD]
R34  0R  [R0603_IPC_MD]
R36  0R  [R0603_IPC_MD]  (no BOM)
R37  100k  [R0603_IPC_MD]
R38  100k  [R0603_IPC_MD]
R39  330R  [R0603_IPC_MD]
R40  0R  [R0603_IPC_MD]
R41  0R  [R0603_IPC_MD]
R42  330R  [R0603_IPC_MD]
R43  330R  [R0603_IPC_MD]
R44  10k  [C0603_IPC_HD]
R45  10k  [C0603_IPC_HD]
R46  10k  [C0603_IPC_HD]
R47  0R  [R0603_IPC_MD]  (no BOM)
R48  0R  [R0603_IPC_MD]  (no BOM)
R49  100k  [R0603_IPC_MD]
R50  100k  [R0603_IPC_MD]
R120  499k  [C0603_IPC_HD]
TP1  Test Point  [TestPoint_1M5]  (value not drawn)  (no BOM)
TP3  Test Point  [TestPoint_1M5]  (value not drawn)  (no BOM)
U1  ISL9237HRZ-T7A  [QFN127P600-ISL9237]
X1  PC104 2,54mm 2*10P  [ESQ-110-33-T-D]

### Ports
AMON/BMON (out), BAT_HEAT1 (in), BAT_HEAT2 (in), PSYS (out), SCL, SDA, TEMP1 (out), TEMP2 (out), VBAT1 (out), VBAT2 (out), ~{CB_EN} (in)

### Nets
3V3_MCU: R34.2 X1.9(VCC) X1.10(VCC)
DGND: C1.2 C2.1 C3.1 C4.1 C5.1 C6.1 C7.1 C8.1 C9.1 C10.1 C11.1 C12.1 C13.1 C14.1 C15.1 C16.1 C17.2 C18.1 C19.1 C20.1 C21.1 C22.1 C23.1 C25.1 C26.1 C27.1 C30.1 C31.1 C33.2 C34.2 C35.1 C36.1 C37.2 C38.1 C39.1 C40.1 C41.2 C42.2 C43.1 C44.1 Q5.1(S) Q6.1(S) Q8.2(S) Q9.2(S) Q10.2(S) R19.1 R20.2 R23.1 R28.1 R49.1 R50.1 TP1.0 TP3.0 U1.33(PGND) X1.1(GND) X1.2(GND) X1.3(GND) X1.4(GND)
POWER: D1.1 Q1.3(D) R13.2
PULLUP: R26.2 R27.1 R34.1 R36.2 R37.2 R38.2 R39.2 R42.2 R43.2 R44.2 R45.2 R46.2
VBAT1: C41.1 Q7.3(D) U1.31(VBAT) X1.17(Vbat) X1.18(Vbat) X1.19(Vbat) X1.20(Vbat)  [also labelled VBAT]
VDD_ISL: C39.2 R24.2 R36.1 U1.18(VDD)
VSYS_IN: C1.1 C2.2 C3.2 C4.2 C5.2 C6.2 C7.2 C8.2 C9.2 C10.2 C11.2 C12.2 C13.2 C14.2 C15.2 C16.2 C17.1 C30.2 D1.2 Q4.3(D) R12.1 R14.2 U1.3(VSYS)
ACOK: Q8.1(G) R44.1 U1.24(ACOK)
ADP: Q1.1(S) Q2.1(S) U1.16(ADP)
BATGONE: R22.1 R40.1 R47.2
BGATE: Q7.2(G) U1.32(BGATE)
OTGEN: R41.1 R48.2 U1.20(OTGEN/CMIN)
OTGPG: Q10.1(G) R46.1 U1.26(OTGPG/CMOUT)
PROCHOT: Q9.1(G) R45.1 U1.23(PROCHOT#)
NetC18_2: C18.2 C19.2 C20.2 C21.2 C22.2 Q3.3(D) R2.2 R4.2
NetC23_2: C23.2 Q2.3(D) R2.1 R3.2 R120.1
NetC24_1: C24.1 C26.2 R6.1 U1.15(CSIP)
NetC24_2: C24.2 C27.2 R7.1 U1.14(CSIN)
NetC25_2: C25.2 Q1.2(G) Q2.2(G) U1.13(ASGATE)
NetC28_1: C28.1 U1.12(BOOT1)
NetC28_2: C28.2 R8.1
NetC29_1: C29.1 R9.1
NetC29_2: C29.2 U1.4(BOOT2)
NetC31_2: C31.2 C32.2 R11.2 U1.2(CSOP)
NetC32_1: C32.1 C34.1 R15.2 U1.1(CSON)
NetC33_1: C33.1 C37.1 Q7.1(S) R14.1 R16.1
NetC35_2: C35.2 R13.1 R19.2 U1.19(ACIN)
NetC36_2: C36.2 U1.29(AMON/BMON) ; port AMON/BMON
NetC38_2: C38.2 R22.2 U1.25(BATGONE)
NetC40_2: C40.2 R24.1 U1.8(VDDP)
NetC42_1: C42.1 R29.2 U1.28(COMP)
NetC43_2: C43.2 R29.1
NetC44_2: C44.2 R30.2 U1.17(DCIN)
NetD1_3: D1.3 R30.1
NetD2_1: D2.1(C) Q8.3(D)
NetD2_2: D2.2(A) R39.1
NetD3_1: D3.1(C) Q9.3(D)
NetD3_2: D3.2(A) R42.1
NetD4_1: D4.1(C) Q10.3(D)
NetD4_2: D4.2(A) R43.1
NetL1_1: L1.1 Q3.1(S) Q5.3(D) R8.2 U1.10(PHASE1)
NetL1_2: L1.2 Q4.1(S) Q6.3(D) R9.2 U1.6(PHASE2)
NetQ3_2: Q3.2(G) U1.11(UGATE1)
NetQ4_2: Q4.2(G) U1.5(UGATE2)
NetQ5_2: Q5.2(G) U1.9(LGATE1)
NetQ6_2: Q6.2(G) U1.7(LGATE2)
NetR3_1: R3.1 R6.2
NetR4_1: R4.1 R7.2
NetR11_1: R11.1 R12.2
NetR15_1: R15.1 R16.2
NetR20_1: R20.1 R120.2 ; port PSYS
NetR23_2: R23.2 U1.30(PSYS)
NetR26_1: R26.1 U1.22(SCL) ; port SCL
NetR27_2: R27.2 U1.21(SDA) ; port SDA
NetR28_2: R28.2 U1.27(PROG)
NetR37_1: R37.1 R40.2
NetR38_1: R38.1 R41.2
NetR47_1: R47.1 R49.2
NetR48_1: R48.1 R50.2
NetX1_5: X1.5(~{CB_EN}) ; port ~{CB_EN}
NetX1_6: X1.6(A0) ; port TEMP1
NetX1_8: X1.8(A1) ; port TEMP2
NetX1_11: X1.11(Vbat1) ; port VBAT1
NetX1_12: X1.12(Vbat2) ; port VBAT2
NetX1_14: X1.14(H0) ; port BAT_HEAT1
NetX1_16: X1.16(H1) ; port BAT_HEAT2

Not connected (* = marked no-connect by the designer): X1 7(NC) 13(NC) 15(NC)

### Notes on the sheet
- (in symbol ISL9237HRZ-T7A) ISL9237; Battery Charger
- (in symbol PC104_2.54mm_20P) Battery Connector

### Library data of the parts
C1 C17 = CPT68uF_16V: 68µF Molded Tantalum Polymer Capacitor 16V 2917 (7343 Metric) 50 mOhm; Manufacturer: AVX Corporation; Manufacturer Part Number: TCJY686M016R0050; Dielectric: X7R; Voltage: 16V; Value: 68µF; Supplier 1: Digi-Key; Supplier Part Number 1: 478-9518-1-ND
C2 C3 C24 C32 C44 = CL10B105MO8NNWC: CAP CER 1UF 16V X7R 0603; Manufacturer: Samsung Electro-Mechanics; Manufacturer Part Number: CL10B105MO8NNWC; Voltage: 16V; Value: 1u; Dielectric: X7R; Supplier 1: Digi-Key; Supplier Part Number 1: 1276-6524-1-ND
C4-C11 C19-C23 C33 C37 = CL21B106KOQNNNG: as C46 on sheet US_EPS_BR; Manufacturer Part Number: CL21B106KOQNNNG; Voltage: 16V; Value: 10u; Dielectric: X7R; Supplier 1: Digi-Key; Supplier Part Number 1: 1276-6472-1-ND
C12-C16 C25-C27 C30 C31 C34 C35 C41 C42 = CL10B104KO8NNNC: as C45 on sheet US_EPS_BR; Manufacturer Part Number: CL10B104KO8NNNC; Voltage: 16V; Value: 100n; Dielectric: X7R; Supplier 1: Digi-Key; Supplier Part Number 1: 1276-1005-1-ND
C18 C43 = CL10B103KB8NNNC: CAP CER 0.01UF 50V X7R 0603; Manufacturer: Samsung Electro-Mechanics; Manufacturer Part Number: CL10B103KB8NNNC; Voltage: 50V; Value: 10n; Dielectric: X7R; Supplier 1: Digi-Key; Supplier Part Number 1: 1276-1009-1-ND
C28 C29 = CL0603_0.22uF_25V: 0.22µF ±10% 25V Ceramic Capacitor X7R 0603 (1608 Metric); Manufacturer: Wurth Electronics Inc.; Manufacturer Part Number: 885012206073; Voltage: 25V; Value: 0.22µF; Dielectric: X7R; Supplier 1: Digi-Key; Supplier Part Number 1: 732-7991-1-ND
C36 = CL0603_1nF_0603: as C54 on sheet US_EPS_BR; Voltage: 50V; Value: 1nF; Dielectric: X7R; Supplier 1: Digi-Key; Supplier Part Number 1: 1276-1018-1-ND
C38 = CL10C180JB8NNNC: CAP CER 18PF 50V C0G/NP0 0603; Manufacturer: Samsung Electro-Mechanics; Manufacturer Part Number: CL10C180JB8NNNC; Voltage: 50V; Value: 18p; Dielectric: C0G/NP0; Supplier 1: Digi-Key; Supplier Part Number 1: 1276-1089-1-ND
C39 C40 = CL0603_4.7uF_10V: as C49 on sheet US_EPS_BR; Voltage: 10V; Value: 4.7µF; Supplier 1: Digi-Key; Supplier Part Number 1: 1276-1044-1-ND
D1 = BAT54CQ-7: Diode Schottky 30V 200mA Surface Mount SOT-23(ISL9237); Manufacturer: Diodes Incorporated; Manufacturer Part Number: BAT54CQ-7-F; Reverse Recovery Time (trr): 5ns; Voltage - DC Reverse (Vr) (Max): 30V; Supplier 1: Digi-Key; Supplier Part Number 1: BAT54CQ-7-FDICT-ND; Current - Average Rectified (Io): 200mA
D2-D4 = LTST-C190GKT: LED GREEN CLEAR CHIP SMD 0603; Manufacturer: Lite-On Inc.; Manufacturer Part Number: LTST-C190GKT; Color: Green; Supplier 1: Digi-Key; Supplier Part Number 1: 160-1183-1-ND
L1 = 2.2uH Inductor 6.3A 13 mOm: 2.2µH Semi-Shielded Wirewound Inductor 6.3A 13 mOhm Max Nonstandard; Manufacturer: Bourns Inc.; Manufacturer Part Number: SRN8040-2R2Y; Value: 2.2uH; Supplier 1: Digi-Key; Supplier Part Number 1: SRN8040-2R2YCT-ND
Q1 Q2 Q7 = SISH625DN-T1: P-Channel 30V 17.3A (Ta), 35A (Tc) 3.7W (Ta), 52W (Tc) Surface Mount PowerPAK® 1212-8SH; Manufacturer: Vishay Siliconix; Manufacturer Part Number: SISH625DN-T1-GE3; Supplier 1: Digi-Key; Supplier Part Number 1: SISH625DN-T1-GE3CT-ND
Q3-Q6 = SiSA14DN: N-Channel 30V 20A (Tc) 3.57W (Ta), 26.5W (Tc) Surface Mount PowerPAK® 1212-8; Manufacturer: Vishay Siliconix; Manufacturer Part Number: SISA14DN-T1-GE3; Supplier 1: Digi-Key; Supplier Part Number 1: SISA14DN-T1-GE3CT-ND
Q8-Q10 = BSS138: N-Channel Logic Level Enhancement Mode Field Effect Transistor; Manufacturer: Diodes Incorporated; Manufacturer Part Number: BSS138; Supplier 1: Digi-Key; Supplier Part Number 1: BSS138-FDICT-ND
R2 = WSLP1206R002: 20 mOhms ±1% 1W Chip Resistor 1206 (3216 Metric) Anti-Sulfur, Automotive AEC-Q200, Current Sense, Moisture Resistant, Pulse Withstanding Metal Element; Manufacturer: Vishay Dale; Manufacturer Part Number: WSLP1206R0200FEA; Value: 20mR; Tolarance: 1%; Supplier 1: Digi-Key; Supplier Part Number 1: WSLP-.02CT-ND
R3 R4 R8 R9 R12 R16 R34 R36 R40 R41 R47 R48 = CR0603-J/-000ELF: as R69 on sheet US_EPS_BIC; Value: 0R; Manufacturer Part Number: CR0603-J/-000ELF; Supplier 1: Digi-Key; Supplier Part Number 1: CR0603-J/-000ELFCT-ND
R6 R7 R11 R15 R30 = CR0603-JW-2R: 2 Ohms ±1% 0.125W, 1/8W Chip Resistor 0603 (1608 Metric) Automotive AEC-Q200 Thick Film; Manufacturer: KOA Speer Electronics, Inc.; Manufacturer Part Number: RK73H1JTTD2R00F; Value: 2R; Tolarance: ±1%; Supplier 1: Digi-Key; Supplier Part Number 1: 2019-RK73H1JTTD2R00FCT-ND
R13 = CR0603-JW-402K: RES 402K OHM 1% 1/10W 0603; Manufacturer: Stackpole Electronics Inc; Manufacturer Part Number: RMCF0603FT402K; Value: 402k; Tolarance: ±1%; Supplier 1: Digi-Key; Supplier Part Number 1: RMCF0603FT402KCT-ND
R14 = WSLP1206R001: 10 mOhms ±1% 1W Chip Resistor 1206 (3216 Metric) Anti-Sulfur, Automotive AEC-Q200, Current Sense, Moisture Resistant, Pulse Withstanding Metal Element; Manufacturer: Vishay Dale; Manufacturer Part Number: WSLP1206R0100FEA; Value: 10mR; Tolarance: 1%; Supplier 1: Digi-Key; Supplier Part Number 1: WSLP-.01CT-ND
R19 R22 R37 R38 R49 R50 = CR0603-JW-104ELF: RES 100K OHM 1% 1/10W 0603; Manufacturer: Stackpole Electronics Inc; Manufacturer Part Number: RMCF0603FT100K; Value: 100k; Tolarance: ±1%; Supplier 1: Digi-Key; Supplier Part Number 1: RMCF0603FT100KCT-ND
R20 = CR0603-JW-158k: 58K ±1% 1/10W ±100ppm/℃ 0603; Manufacturer: PANASONIC; Manufacturer Part Number: ERJ3EKF1583V; Value: 158k; Tolarance: 1%; Supplier 1: LCSC; Supplier Part Number 1: C403004
R23 = CR0603-JW-6.04K: RES 6.04K OHM 1% 1/10W 0603; Manufacturer: Stackpole Electronics Inc; Manufacturer Part Number: RMCF0603FT6K04; Value: 6.04k; Tolarance: ±1%; Supplier 1: Digi-Key; Supplier Part Number 1: RMCF0603FT6K04CT-ND
R24 = CR0603-JW-4.7R: RES 4.7 OHM 1% 1/10W 0603; Manufacturer: Stackpole Electronics Inc; Manufacturer Part Number: RMCF0603FT4R70; Value: 4.7R; Tolarance: ±1%; Supplier 1: Digi-Key; Supplier Part Number 1: RMCF0603FT4R70CT-ND
R26 R27 R44-R46 = CR0603-JW-10k: as R67 on sheet US_EPS_BR; Value: 10k; Tolarance: ±1%; Supplier 1: Digi-Key; Supplier Part Number 1: RMCF0603FT10K0CT-ND
R28 = CR0603-JW-147kR: RES 143K OHM 1% 1/10W 0603; Manufacturer: Stackpole Electronics Inc; Manufacturer Part Number: RMCF0603FT143K; Value: 143k; Tolarance: ±1%; Supplier 1: Digi-Key; Supplier Part Number 1: RMCF0603FT143KCT-ND
R29 = CR0603-JW-102ELF: RES SMD 1K OHM 5% 1/10W 0603; Manufacturer: Bourns Inc.; Value: 1k; Tolarance: 5%; Manufacturer Part Number: CR0603-JW-102ELF; Supplier 1: Digi-Key; Supplier Part Number 1: CR0603-JW-102ELFCT-ND
R39 R42 R43 = CR0603-JW-331ELF: RES SMD 330 OHM 5% 1/10W 0603; Manufacturer: Bourns Inc.; Value: 330R; Tolarance: 5%; Manufacturer Part Number: CR0603-JW-331ELF; Supplier 1: Digi-Key; Supplier Part Number 1: CR0603-JW-331ELFCT-ND
R120 = CR0603-JW-499K: RES 499K OHM 1% 1/10W 0603; Manufacturer: Stackpole Electronics Inc; Manufacturer Part Number: RMCF0603FT499K; Value: 499k; Tolarance: ±1%; Supplier 1: Digi-Key; Supplier Part Number 1: RMCF0603FT499KCT-ND
TP1 TP3 = TP
U1 = ISL9237HRZ-T7A: Charger IC Lithium-Ion 32-QFN (4x4); Manufacturer: Renesas Electronics America Inc.; Manufacturer Part Number: ISL9237HRZ-T7A; Supplier 1: Digi-Key; Supplier Part Number 1: ISL9237HRZ-T7ACT-ND
X1 = PC104_2.54mm_20P: 20 Position Elevated Socket Connector  Through Hole; Manufacturer: China; Number of Positions: 20; Manufacturer Part Number: PC104 2,54mm 2*10P; Supplier 1: Aliexpress.com; Supplier Part Number 1: PC104 2,54mm 2*10P

## Sheet US_EPS_LM.SchDoc
size A2
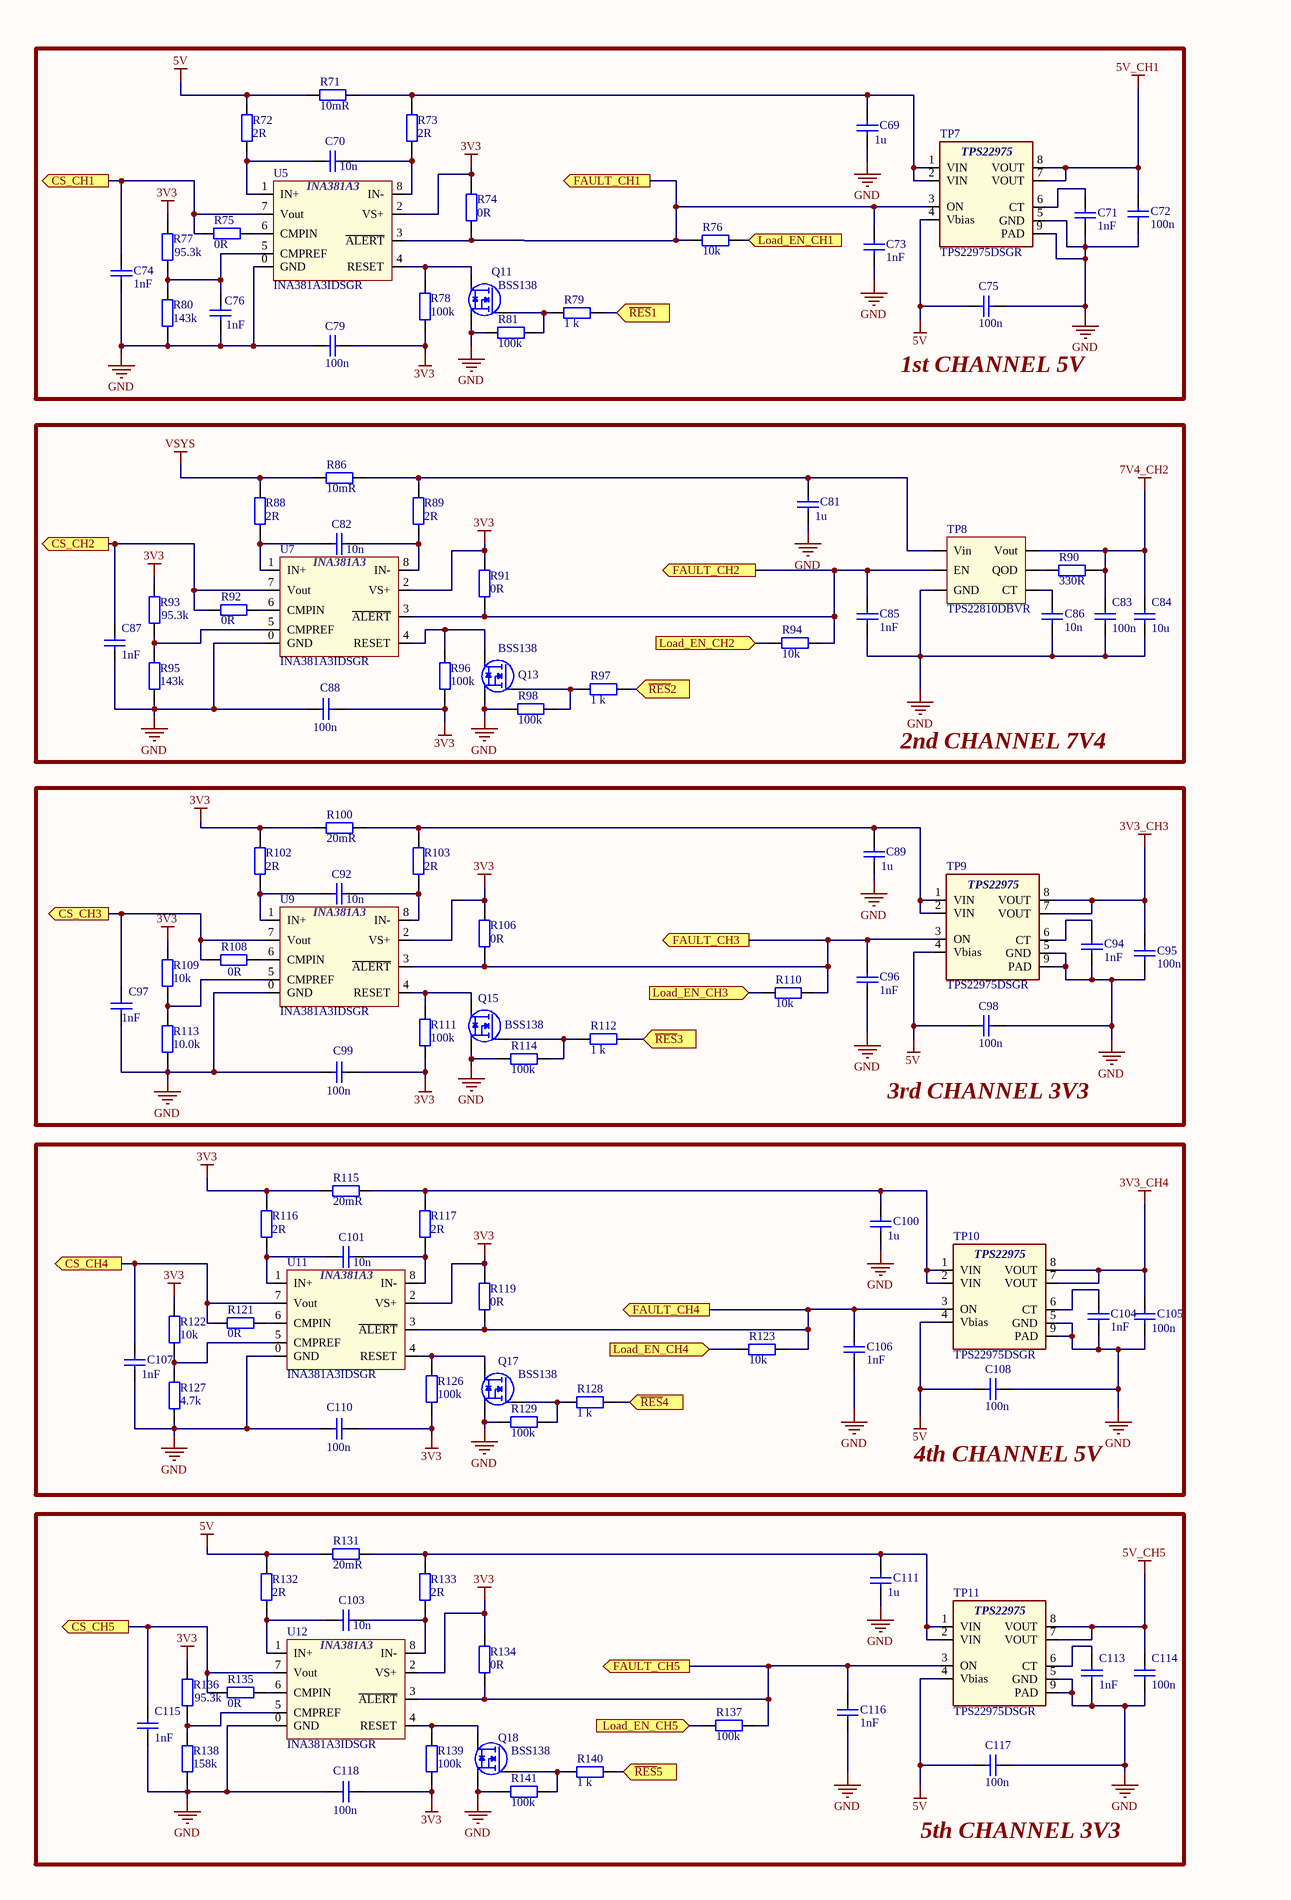
[diagram p4: US_EPS_LM.SchDoc, left]
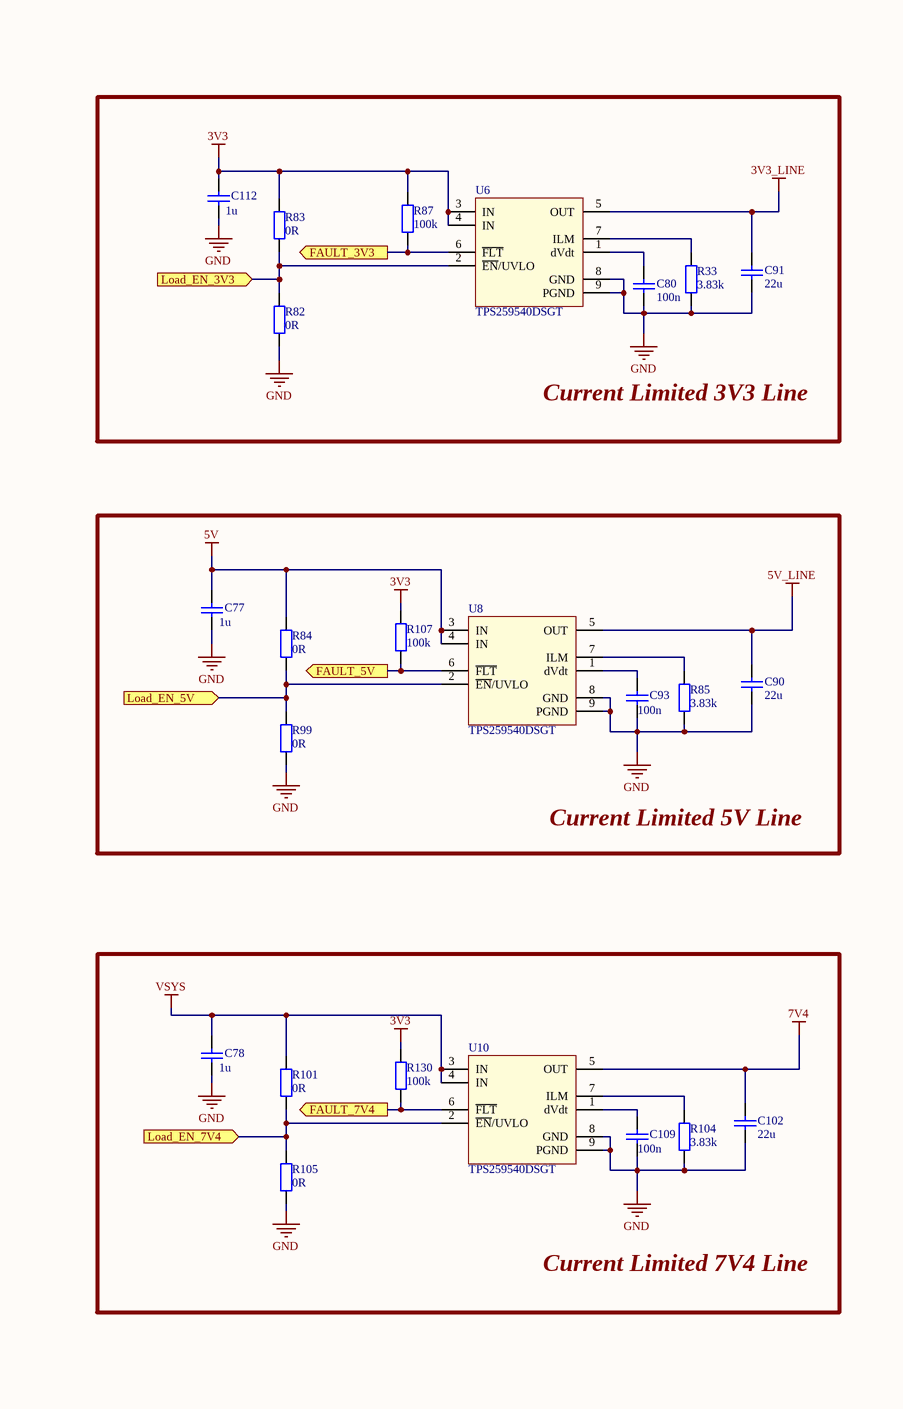
[diagram p5: US_EPS_LM.SchDoc, right]

### Parts
C69  1u  [C0603_IPC_HD]
C70  10n  [C0603_IPC_HD]
C71  1nF  [C0603_IPC_HD]
C72  100n  [C0603_IPC_HD]
C73  1nF  [C0603_IPC_HD]
C74  1nF  [C0603_IPC_HD]
C75  100n  [C0603_IPC_HD]
C76  1nF  [C0603_IPC_HD]
C77  1u  [C0603_IPC_HD]
C78  1u  [C0603_IPC_HD]
C79  100n  [C0603_IPC_HD]
C80  100n  [C0603_IPC_HD]
C81  1u  [C0603_IPC_HD]
C82  10n  [C0603_IPC_HD]
C83  100n  [C0603_IPC_HD]
C84  10u  [C0805_IPC_HD]
C85  1nF  [C0603_IPC_HD]
C86  10n  [C0603_IPC_HD]
C87  1nF  [C0603_IPC_HD]
C88  100n  [C0603_IPC_HD]
C89  1u  [C0603_IPC_HD]
C90  22u  [C0805_IPC_HD]
C91  22u  [C0805_IPC_HD]
C92  10n  [C0603_IPC_HD]
C93  100n  [C0603_IPC_HD]
C94  1nF  [C0603_IPC_HD]
C95  100n  [C0603_IPC_HD]
C96  1nF  [C0603_IPC_HD]
C97  1nF  [C0603_IPC_HD]
C98  100n  [C0603_IPC_HD]
C99  100n  [C0603_IPC_HD]
C100  1u  [C0603_IPC_HD]
C101  10n  [C0603_IPC_HD]
C102  22u  [C0805_IPC_HD]
C103  10n  [C0603_IPC_HD]
C104  1nF  [C0603_IPC_HD]
C105  100n  [C0603_IPC_HD]
C106  1nF  [C0603_IPC_HD]
C107  1nF  [C0603_IPC_HD]
C108  100n  [C0603_IPC_HD]
C109  100n  [C0603_IPC_HD]
C110  100n  [C0603_IPC_HD]
C111  1u  [C0603_IPC_HD]
C112  1u  [C0603_IPC_HD]
C113  1nF  [C0603_IPC_HD]
C114  100n  [C0603_IPC_HD]
C115  1nF  [C0603_IPC_HD]
C116  1nF  [C0603_IPC_HD]
C117  100n  [C0603_IPC_HD]
C118  100n  [C0603_IPC_HD]
Q11  BSS138  [SOT23]
Q13  BSS138  [SOT23]
Q15  BSS138  [SOT23]
Q17  BSS138  [SOT23]
Q18  BSS138  [SOT23]
R33  3.83k  [C0603_IPC_HD]
R71  10mR  [WSLP1206R001]
R72  2R  [C0603_IPC_HD]
R73  2R  [C0603_IPC_HD]
R74  0R  [R0603_IPC_MD]
R75  0R  [R0603_IPC_MD]
R76  10k  [C0603_IPC_HD]
R77  95.3k  [C0603_IPC_HD]
R78  100k  [R0603_IPC_MD]
R79  1 k  [R0603_IPC_HD]
R80  143k  [C0603_IPC_HD]
R81  100k  [R0603_IPC_MD]
R82  0R  [R0603_IPC_MD]  (no BOM)
R83  0R  [R0603_IPC_MD]  (no BOM)
R84  0R  [R0603_IPC_MD]  (no BOM)
R85  3.83k  [C0603_IPC_HD]
R86  10mR  [WSLP1206R001]
R87  100k  [R0603_IPC_MD]
R88  2R  [C0603_IPC_HD]
R89  2R  [C0603_IPC_HD]
R90  330R  [R0603_IPC_MD]
R91  0R  [R0603_IPC_MD]
R92  0R  [R0603_IPC_MD]
R93  95.3k  [C0603_IPC_HD]
R94  10k  [C0603_IPC_HD]
R95  143k  [C0603_IPC_HD]
R96  100k  [R0603_IPC_MD]
R97  1 k  [R0603_IPC_HD]
R98  100k  [R0603_IPC_MD]
R99  0R  [R0603_IPC_MD]  (no BOM)
R100  20mR  [WSLP1206R002]
R101  0R  [R0603_IPC_MD]  (no BOM)
R102  2R  [C0603_IPC_HD]
R103  2R  [C0603_IPC_HD]
R104  3.83k  [C0603_IPC_HD]
R105  0R  [R0603_IPC_MD]  (no BOM)
R106  0R  [R0603_IPC_MD]
R107  100k  [R0603_IPC_MD]
R108  0R  [R0603_IPC_MD]
R109  10k  [C0603_IPC_HD]
R110  10k  [C0603_IPC_HD]
R111  100k  [R0603_IPC_MD]
R112  1 k  [R0603_IPC_HD]
R113  10.0k  [R0603_IPC_MD]
R114  100k  [R0603_IPC_MD]
R115  20mR  [WSLP1206R002]
R116  2R  [C0603_IPC_HD]
R117  2R  [C0603_IPC_HD]
R119  0R  [R0603_IPC_MD]
R121  0R  [R0603_IPC_MD]
R122  10k  [C0603_IPC_HD]
R123  10k  [C0603_IPC_HD]
R126  100k  [R0603_IPC_MD]
R127  4.7k  [C0603_IPC_HD]
R128  1 k  [R0603_IPC_HD]
R129  100k  [R0603_IPC_MD]
R130  100k  [R0603_IPC_MD]
R131  20mR  [WSLP1206R002]
R132  2R  [C0603_IPC_HD]
R133  2R  [C0603_IPC_HD]
R134  0R  [R0603_IPC_MD]
R135  0R  [R0603_IPC_MD]
R136  95.3k  [C0603_IPC_HD]
R137  100k  [R0603_IPC_MD]
R138  158k  [R0603_IPC_HD]
R139  100k  [R0603_IPC_MD]
R140  1 k  [R0603_IPC_HD]
R141  100k  [R0603_IPC_MD]
TP7  TPS22975DSGR  [SON127P600-TPS22975]
TP8  TPS22810DBVR  [TPS22810DBVR_SOT95P280X145-6N]
TP9  TPS22975DSGR  [SON127P600-TPS22975]
TP10  TPS22975DSGR  [SON127P600-TPS22975]
TP11  TPS22975DSGR  [SON127P600-TPS22975]
U5  INA381A3IDSGR  [SON127P600-8N(INA381)]
U6  TPS259540DSGT  [SON127P600-8N_TPS259540DSGT]
U7  INA381A3IDSGR  [SON127P600-8N(INA381)]
U8  TPS259540DSGT  [SON127P600-8N_TPS259540DSGT]
U9  INA381A3IDSGR  [SON127P600-8N(INA381)]
U10  TPS259540DSGT  [SON127P600-8N_TPS259540DSGT]
U11  INA381A3IDSGR  [SON127P600-8N(INA381)]
U12  INA381A3IDSGR  [SON127P600-8N(INA381)]

### Blocks framed on the sheet
1st CHANNEL 5V: C69-C76 C79 Q11 R71-R81 TP7 U5
Current Limited 3V3 Line: C80 C91 C112 R33 R82 R83 R87 U6
2nd CHANNEL 7V4: C81-C88 Q13 R86 R88-R98 TP8 U7
Current Limited 5V Line: C77 C90 C93 R84 R85 R99 R107 U8
3rd CHANNEL 3V3: C89 C92 C94-C99 Q15 R100 R102 R103 R106 R108-R114 TP9 U9
Current Limited 7V4 Line: C78 C102 C109 R101 R104 R105 R130 U10
4th CHANNEL 5V: C100 C101 C104-C108 C110 Q17 R115-R117 R119 R121-R123 R126-R129 TP10 U11
5th CHANNEL 3V3: C103 C111 C113-C118 Q18 R131-R141 TP11 U12

### Ports
CS_CH1 (out), CS_CH2 (out), CS_CH3 (out), CS_CH4 (out), CS_CH5 (out), FAULT_3V3 (out), FAULT_5V (out), FAULT_7V4 (out), FAULT_CH1 (out), FAULT_CH2 (out), FAULT_CH3 (out), FAULT_CH4 (out), FAULT_CH5 (out), Load_EN_3V3 (in), Load_EN_5V (in), Load_EN_7V4 (in), Load_EN_CH1 (in), Load_EN_CH2 (in), Load_EN_CH3 (in), Load_EN_CH4 (in), Load_EN_CH5 (in), ~{RES}1 (in), ~{RES}2 (in), ~{RES}3 (in), ~{RES}4 (in), ~{RES}5 (in)

### Nets
3V3: C79.1 C88.2 C99.2 C110.2 C112.2 C118.2 R74.1 R77.2 R78.1 R83.2 R87.2 R91.1 R93.2 R96.2 R100.1 R102.2 R106.1 R107.2 R109.1 R111.2 R115.1 R116.2 R119.1 R122.1 R126.2 R130.2 R134.1 R136.2 R139.2 U5.2(VS+) U6.3(IN) U6.4(IN) U7.2(VS+) U9.2(VS+) U11.2(VS+) U12.2(VS+)
3V3_CH3: C95.2 TP9.7(VOUT) TP9.8(VOUT)
3V3_CH4: C105.2 TP10.7(VOUT) TP10.8(VOUT)
3V3_LINE: C91.2 U6.5(OUT)
5V: C75.2 C77.2 C98.2 C108.2 C117.2 R71.1 R72.2 R84.2 R131.1 R132.2 TP7.4(Vbias) TP9.4(Vbias) TP10.4(Vbias) TP11.4(Vbias) U8.3(IN) U8.4(IN)
5V_CH1: C72.2 TP7.7(VOUT) TP7.8(VOUT)
5V_CH5: C114.2 TP11.7(VOUT) TP11.8(VOUT)
5V_LINE: C90.2 U8.5(OUT)
7V4: C102.2 U10.5(OUT)
7V4_CH2: C83.2 C84.2 R90.1 TP8.6(Vout)
GND: C69.1 C71.1 C72.1 C73.1 C74.1 C75.1 C76.1 C77.1 C78.1 C79.2 C80.2 C81.1 C83.1 C84.1 C85.1 C86.1 C87.1 C88.1 C89.1 C90.1 C91.1 C93.2 C94.1 C95.1 C96.1 C97.1 C98.1 C99.1 C100.1 C102.1 C104.1 C105.1 C106.1 C107.1 C108.1 C109.2 C110.1 C111.1 C112.1 C113.1 C114.1 C115.1 C116.1 C117.1 C118.1 Q11.2(S) Q13.2(S) Q15.2(S) Q17.2(S) Q18.2(S) R33.1 R80.1 R81.2 R82.1 R85.1 R95.1 R98.1 R99.1 R104.1 R105.1 R113.1 R114.1 R127.1 R129.1 R138.1 R141.1 TP7.5(GND) TP7.9(PAD) TP8.2(GND) TP9.5(GND) TP9.9(PAD) TP10.5(GND) TP10.9(PAD) TP11.5(GND) TP11.9(PAD) U5.0(GND) U6.8(GND) U6.9(PGND) U7.0(GND) U8.8(GND) U8.9(PGND) U9.0(GND) U10.8(GND) U10.9(PGND) U11.0(GND) U12.0(GND)
VSYS: C78.2 R86.1 R88.2 R101.2 U10.3(IN) U10.4(IN)
NetC69_2: C69.2 R71.2 R73.2 TP7.1(VIN) TP7.2(VIN)
NetC70_1: C70.1 R72.1 U5.1(IN+)
NetC70_2: C70.2 R73.1 U5.8(IN-)
NetC71_2: C71.2 TP7.6(CT)
NetC73_2: C73.2 R74.2 R76.2 TP7.3(ON) U5.3(~{ALERT}) ; port FAULT_CH1
NetC74_2: C74.2 R75.1 U5.7(Vout) ; port CS_CH1
NetC76_2: C76.2 R77.1 R80.2 U5.5(CMPREF)
NetC80_1: C80.1 U6.1(dVdt)
NetC81_2: C81.2 R86.2 R89.2 TP8.1(Vin)
NetC82_1: C82.1 R88.1 U7.1(IN+)
NetC82_2: C82.2 R89.1 U7.8(IN-)
NetC85_2: C85.2 R91.2 R94.1 TP8.3(EN) U7.3(~{ALERT}) ; port FAULT_CH2
NetC86_2: C86.2 TP8.4(CT)
NetC87_2: C87.2 R92.1 U7.7(Vout) ; port CS_CH2
NetC89_2: C89.2 R100.2 R103.2 TP9.1(VIN) TP9.2(VIN)
NetC92_1: C92.1 R102.1 U9.1(IN+)
NetC92_2: C92.2 R103.1 U9.8(IN-)
NetC93_1: C93.1 U8.1(dVdt)
NetC94_2: C94.2 TP9.6(CT)
NetC96_2: C96.2 R106.2 R110.1 TP9.3(ON) U9.3(~{ALERT}) ; port FAULT_CH3
NetC97_2: C97.2 R108.2 U9.7(Vout) ; port CS_CH3
NetC100_2: C100.2 R115.2 R117.2 TP10.1(VIN) TP10.2(VIN)
NetC101_1: C101.1 R116.1 U11.1(IN+)
NetC101_2: C101.2 R117.1 U11.8(IN-)
NetC103_1: C103.1 R132.1 U12.1(IN+)
NetC103_2: C103.2 R133.1 U12.8(IN-)
NetC104_2: C104.2 TP10.6(CT)
NetC106_2: C106.2 R119.2 R123.1 TP10.3(ON) U11.3(~{ALERT}) ; port FAULT_CH4
NetC107_2: C107.2 R121.2 U11.7(Vout) ; port CS_CH4
NetC109_1: C109.1 U10.1(dVdt)
NetC111_2: C111.2 R131.2 R133.2 TP11.1(VIN) TP11.2(VIN)
NetC113_2: C113.2 TP11.6(CT)
NetC115_2: C115.2 R135.2 U12.7(Vout) ; port CS_CH5
NetC116_2: C116.2 R134.2 R137.1 TP11.3(ON) U12.3(~{ALERT}) ; port FAULT_CH5
NetQ11_1: Q11.1(G) R79.1 R81.1
NetQ11_3: Q11.3(D) R78.2 U5.4(RESET)
NetQ13_1: Q13.1(G) R97.1 R98.2
NetQ13_3: Q13.3(D) R96.1 U7.4(RESET)
NetQ15_1: Q15.1(G) R112.1 R114.2
NetQ15_3: Q15.3(D) R111.1 U9.4(RESET)
NetQ17_1: Q17.1(G) R128.1 R129.2
NetQ17_3: Q17.3(D) R126.1 U11.4(RESET)
NetQ18_1: Q18.1(G) R140.1 R141.2
NetQ18_3: Q18.3(D) R139.1 U12.4(RESET)
NetR33_2: R33.2 U6.7(ILM)
NetR75_2: R75.2 U5.6(CMPIN)
NetR76_1: R76.1 ; port Load_EN_CH1
NetR79_2: R79.2 ; port ~{RES}1
NetR82_2: R82.2 R83.1 U6.2(~{EN}/UVLO) ; port Load_EN_3V3
NetR84_1: R84.1 R99.2 U8.2(~{EN}/UVLO) ; port Load_EN_5V
NetR85_2: R85.2 U8.7(ILM)
NetR87_1: R87.1 U6.6(~{FLT}) ; port FAULT_3V3
NetR90_2: R90.2 TP8.5(QOD)
NetR92_2: R92.2 U7.6(CMPIN)
NetR93_1: R93.1 R95.2 U7.5(CMPREF)
NetR94_2: R94.2 ; port Load_EN_CH2
NetR97_2: R97.2 ; port ~{RES}2
NetR101_1: R101.1 R105.2 U10.2(~{EN}/UVLO) ; port Load_EN_7V4
NetR104_2: R104.2 U10.7(ILM)
NetR107_1: R107.1 U8.6(~{FLT}) ; port FAULT_5V
NetR108_1: R108.1 U9.6(CMPIN)
NetR109_2: R109.2 R113.2 U9.5(CMPREF)
NetR110_2: R110.2 ; port Load_EN_CH3
NetR112_2: R112.2 ; port ~{RES}3
NetR121_1: R121.1 U11.6(CMPIN)
NetR122_2: R122.2 R127.2 U11.5(CMPREF)
NetR123_2: R123.2 ; port Load_EN_CH4
NetR128_2: R128.2 ; port ~{RES}4
NetR130_1: R130.1 U10.6(~{FLT}) ; port FAULT_7V4
NetR135_1: R135.1 U12.6(CMPIN)
NetR136_1: R136.1 R138.2 U12.5(CMPREF)
NetR137_2: R137.2 ; port Load_EN_CH5
NetR140_2: R140.2 ; port ~{RES}5

### Notes on the sheet
- (in symbol INA381A3IDSGR) INA381A3

### Library data of the parts
C69 C77 C78 C81 C89 C100 C111 C112 = CL10B105MO8NNWC: as C2 on sheet US_EPS_HW; Manufacturer Part Number: CL10B105MO8NNWC; Voltage: 16V; Value: 1u; Dielectric: X7R; Supplier 1: Digi-Key; Supplier Part Number 1: 1276-6524-1-ND
C70 C82 C86 C92 C101 C103 = CL10B103KB8NNNC: as C18 on sheet US_EPS_HW; Manufacturer Part Number: CL10B103KB8NNNC; Voltage: 50V; Value: 10n; Dielectric: X7R; Supplier 1: Digi-Key; Supplier Part Number 1: 1276-1009-1-ND
C71 C73 C74 C76 C85 C87 C94 C96 C97 C104 C106 C107 C113 C115 C116 = CL0603_1nF_0603: as C54 on sheet US_EPS_BR; Voltage: 50V; Value: 1nF; Dielectric: X7R; Supplier 1: Digi-Key; Supplier Part Number 1: 1276-1018-1-ND
C72 C75 C79 C80 C83 C88 C93 C95 C98 C99 C105 C108-C110 C114 C117 C118 = CL10B104KO8NNNC: as C45 on sheet US_EPS_BR; Manufacturer Part Number: CL10B104KO8NNNC; Voltage: 16V; Value: 100n; Dielectric: X7R; Supplier 1: Digi-Key; Supplier Part Number 1: 1276-1005-1-ND
C84 = CL21B106KOQNNNG: as C46 on sheet US_EPS_BR; Manufacturer Part Number: CL21B106KOQNNNG; Voltage: 16V; Value: 10u; Dielectric: X7R; Supplier 1: Digi-Key; Supplier Part Number 1: 1276-6472-1-ND
C90 C91 C102 = CL21A226MOCLRNC: as C62 on sheet US_EPS_BR; Manufacturer Part Number: CL21A226MOCLRNC; Voltage: 16V; Value: 22u; Dielectric: X5R; Supplier 1: Digi-Key; Supplier Part Number 1: 1276-6780-1-ND
Q11 Q13 Q15 Q17 Q18 = BSS138: as Q8 on sheet US_EPS_HW; Manufacturer Part Number: BSS138; Supplier 1: Digi-Key; Supplier Part Number 1: BSS138-FDICT-ND
R33 R85 R104 = CR0603-JW-3.83k: as R66 on sheet US_EPS_BR; Value: 3.83k; Tolarance: ±1%; Supplier 1: Digi-Key; Supplier Part Number 1: 311-3.83KHRCT-ND
R71 R86 = WSLP1206R001: as R14 on sheet US_EPS_HW; Value: 10mR; Tolarance: 1%; Supplier 1: Digi-Key; Supplier Part Number 1: WSLP-.01CT-ND
R72 R73 R88 R89 R102 R103 R116 R117 R132 R133 = CR0603-JW-2R: as R6 on sheet US_EPS_HW; Value: 2R; Tolarance: ±1%; Supplier 1: Digi-Key; Supplier Part Number 1: 2019-RK73H1JTTD2R00FCT-ND
R74 R75 R82-R84 R91 R92 R99 R101 R105 R106 R108 R119 R121 R134 R135 = CR0603-J/-000ELF: as R69 on sheet US_EPS_BIC; Value: 0R; Manufacturer Part Number: CR0603-J/-000ELF; Supplier 1: Digi-Key; Supplier Part Number 1: CR0603-J/-000ELFCT-ND
R76 R94 R109 R110 R122 R123 = CR0603-JW-10k: as R67 on sheet US_EPS_BR; Value: 10k; Tolarance: ±1%; Supplier 1: Digi-Key; Supplier Part Number 1: RMCF0603FT10K0CT-ND
R77 R93 R136 = CR0603-JW-95.3k: RES 95.3K OHM 1% 1/10W 0603; Manufacturer: Stackpole Electronics Inc; Manufacturer Part Number: RMCF0603FT95K3; Value: 95.3k; Tolarance: ±1%; Supplier 1: Digi-Key; Supplier Part Number 1: RMCF0603FT95K3CT-ND
R78 R81 R87 R96 R98 R107 R111 R114 R126 R129 R130 R137 R139 R141 = CR0603-JW-104ELF: as R19 on sheet US_EPS_HW; Value: 100k; Tolarance: ±1%; Supplier 1: Digi-Key; Supplier Part Number 1: RMCF0603FT100KCT-ND
R79 R97 R112 R128 R140 = CR0603-JW-1k_ISL92: 1 kOhms ±1% 0.1W, 1/10W Chip Resistor 0603 (1608 Metric) Automotive AEC-Q200 Thick Film; Manufacturer: Stackpole Electronics Inc; Manufacturer Part Number: RMCF0603FT1K00; Value: 1 k; Tolarance: ±1%; Supplier 1: Digi-Key; Supplier Part Number 1: RMCF0603FT1K00CT-ND
R80 R95 = CR0603-JW-147kR: as R28 on sheet US_EPS_HW; Value: 143k; Tolarance: ±1%; Supplier 1: Digi-Key; Supplier Part Number 1: RMCF0603FT143KCT-ND
R90 = CR0603-JW-331ELF: as R39 on sheet US_EPS_HW; Value: 330R; Tolarance: 5%; Manufacturer Part Number: CR0603-JW-331ELF; Supplier 1: Digi-Key; Supplier Part Number 1: CR0603-JW-331ELFCT-ND
R100 R115 R131 = WSLP1206R002: as R2 on sheet US_EPS_HW; Value: 20mR; Tolarance: 1%; Supplier 1: Digi-Key; Supplier Part Number 1: WSLP-.02CT-ND
R113 = RMCF0603FT10K0: RES 10K OHM 1% 1/10W 0603; Manufacturer: Stackpole Electronics Inc; Value: 10.0k; Tolarance: 1%; Manufacturer Part Number: RMCF0603FT10K0; Supplier 1: Digi-Key; Supplier Part Number 1: RMCF0603FT10K0CT-ND
R127 = CR0603-JW-4.7kOm: RES SMD 4.7K OHM 5% 1/10W 0603; Manufacturer: Bourns Inc.; Manufacturer Part Number: CR0603-JW-472ELF; Value: 4.7k; Tolarance: ±5%; Supplier 1: Digi-Key; Supplier Part Number 1: CR0603-JW-472ELFCT-ND
R138 = CR0603-JW-158k: as R20 on sheet US_EPS_HW; Value: 158k; Tolarance: 1%; Supplier 1: LCSC; Supplier Part Number 1: C403004
TP7 TP9-TP11 = TPS22975: IC LOAD SWITCH N-CH 6A; Manufacturer: Texas Instruments; Manufacturer Part Number: TPS22975DSGR; Supplier 1: Digi-Key; Supplier Part Number 1: 296-47228-1-ND
TP8 = TPS22810DBVR: Power Switch/Driver 1:1 N-Channel 2A SOT-23-6; Manufacturer: Texas Instruments; Manufacturer Part Number: TPS22810DBVR; Supplier 1: Digi-Key; Supplier Part Number 1: 296-45297-1-ND
U5 U7 U9 U11 U12 = INA381A3IDSGR: Current Sense Regulator High/Low-Side  8-WSON (2x2); Manufacturer: Texas Instruments; Manufacturer Part Number: INA381A3IDSGR; Supplier 1: Digi-Key; Supplier Part Number 1: 296-50476-1-ND
U6 U8 U10 = TPS259540DSGT: IC PWR MGMT EFUSE 2.7-18V 8WSON; Manufacturer: Texas Instruments; Manufacturer Part Number: TPS259540DSGT; Supplier 1: Digi-Key; Supplier Part Number 1: 296-47957-1-ND